# Altium project Thunderscope_Rev5.PrjPCB (part 2 of 2)

## Sheet CON_PCIe_X4.SchDoc: ThunderScope 1000E
size A4; DrawnBy: Aleksa Bjelogrlic; Revision: 1; SheetNumber: 13; SheetTotal: 14
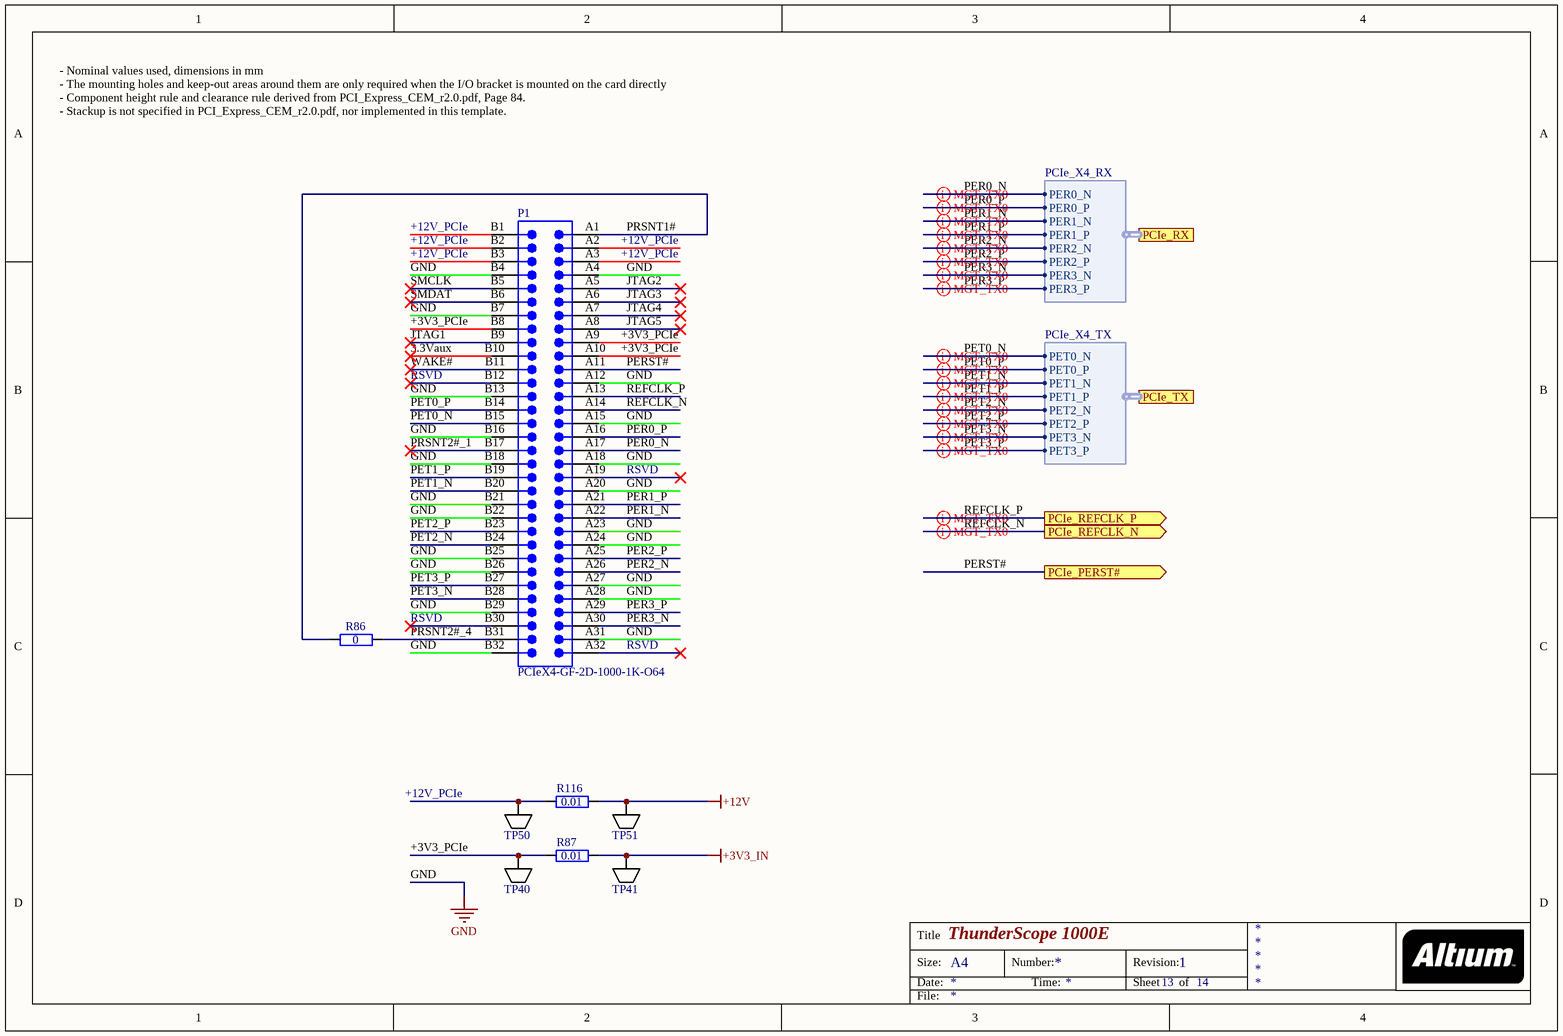
[diagram p9: CON_PCIe_X4.SchDoc]

### Parts
P1  PCIeX4-GF-2D-1000-1K-O64  [PCIeX4-GF-2D-1000-1K-O64]  (no BOM)
R86  0  [GEN_R_0402]
R87  0.01  [GEN_R_0603]
R116  0.01  [GEN_R_0603]
TP40  5015  [KEY_5015]  (value not drawn)
TP41  5015  [KEY_5015]  (value not drawn)
TP50  5015  [KEY_5015]  (value not drawn)
TP51  5015  [KEY_5015]  (value not drawn)

### Ports
PCIe_PERST# (out), PCIe_REFCLK_N (out), PCIe_REFCLK_P (out), PCIe_RX (harness PCIe_X4_RX), PCIe_TX (harness PCIe_X4_TX)

### Harnesses
PCIe_X4_RX: PER0_N, PER0_P, PER1_N, PER1_P, PER2_N, PER2_P, PER3_N, PER3_P
PCIe_X4_TX: PET0_N, PET0_P, PET1_N, PET1_P, PET2_N, PET2_P, PET3_N, PET3_P

### Nets
+3V3_IN: R87.2 TP41.1
+12V: R116.2 TP51.1
GND: P1.A4 P1.A12 P1.A15 P1.A18 P1.A20 P1.A23 P1.A24 P1.A27 P1.A28 P1.A31 P1.B4 P1.B7 P1.B13 P1.B16 P1.B18 P1.B21 P1.B22 P1.B25 P1.B26 P1.B29 P1.B32
3.3Vaux: P1.B10
+3V3_PCIe: P1.A9 P1.A10 P1.B8 R87.1 TP40.1
+12V_PCIe: P1.A2 P1.A3 P1.B1 P1.B2 P1.B3 R116.1 TP50.1
JTAG1: P1.B9
JTAG2: P1.A5
JTAG3: P1.A6
JTAG4: P1.A7
JTAG5: P1.A8
PER0_N: P1.A17 ; port PCIe_RX.PER0_N  [project net PCIe_PER0_N]
PER0_P: P1.A16 ; port PCIe_RX.PER0_P  [project net PCIe_PER0_P]
PER1_N: P1.A22 ; port PCIe_RX.PER1_N  [project net PCIe_PER1_N]
PER1_P: P1.A21 ; port PCIe_RX.PER1_P  [project net PCIe_PER1_P]
PER2_N: P1.A26 ; port PCIe_RX.PER2_N  [project net PCIe_PER2_N]
PER2_P: P1.A25 ; port PCIe_RX.PER2_P  [project net PCIe_PER2_P]
PER3_N: P1.A30 ; port PCIe_RX.PER3_N  [project net PCIe_PER3_N]
PER3_P: P1.A29 ; port PCIe_RX.PER3_P  [project net PCIe_PER3_P]
PERST#: P1.A11 ; port PCIe_PERST#  [project net PCIe_PERST#]
PET0_N: P1.B15 ; port PCIe_TX.PET0_N  [project net PCIe_PET0_N]
PET0_P: P1.B14 ; port PCIe_TX.PET0_P  [project net PCIe_PET0_P]
PET1_N: P1.B20 ; port PCIe_TX.PET1_N  [project net PCIe_PET1_N]
PET1_P: P1.B19 ; port PCIe_TX.PET1_P  [project net PCIe_PET1_P]
PET2_N: P1.B24 ; port PCIe_TX.PET2_N  [project net PCIe_PET2_N]
PET2_P: P1.B23 ; port PCIe_TX.PET2_P  [project net PCIe_PET2_P]
PET3_N: P1.B28 ; port PCIe_TX.PET3_N  [project net PCIe_PET3_N]
PET3_P: P1.B27 ; port PCIe_TX.PET3_P  [project net PCIe_PET3_P]
PRSNT1#: P1.A1 R86.1
PRSNT2#_1: P1.B17
PRSNT2#_4: P1.B31 R86.2
REFCLK_N: P1.A14 ; port PCIe_REFCLK_N  [project net PCIe_REFCLK_N]
REFCLK_P: P1.A13 ; port PCIe_REFCLK_P  [project net PCIe_REFCLK_P]
SMCLK: P1.B5
SMDAT: P1.B6
WAKE#: P1.B11

Not connected (* = marked no-connect by the designer): P1 A19* A32* B12* B30*

### Layout directives
differential pair; differential pair class PCIe: PCIe_PER0_N, PCIe_PER0_P, PCIe_PER1_N, PCIe_PER1_P, PCIe_PER2_N, PCIe_PER2_P, PCIe_PER3_N, PCIe_PER3_P, PCIe_PET0_N, PCIe_PET0_P, PCIe_PET1_N, PCIe_PET1_P, PCIe_PET2_N, PCIe_PET2_P, PCIe_PET3_N, PCIe_PET3_P, PCIe_REFCLK_N, PCIe_REFCLK_P

### Notes on the sheet
- - Nominal values used, dimensions in mm
  - The mounting holes and keep-out areas around them are only required when the I/O bracket is mounted on the card directly
  - Component height rule and clearance rule derived from PCI_Express_CEM_r2.0.pdf, Page 84.
  - Stackup is not specified in PCI_Express_CEM_r2.0.pdf, nor implemented in this template.
- RSVD
- (near R86) RSVD
- Title
- Size:
- Date:
- A4
- Number:
- Time:
- Revision:
- Sheet
- of
- File:

### Library data of the parts
P1 = CMP-0001-00031-2: Golden finger, PCIeX4, Dual, Opposite, Pitch 1mm, 64-Position; Mating Connector: Molex-87715-9106; Datasheet Version: rev2.0, Apr-2007; Package Reference: PCIeX4-GF-2D-1000-1K-O64; ClassName: Edge Connector; Publisher: Altium
R86 = RES 0 OHM 1/16W 0402: as R1 on sheet Main; Package: 0402; Supplier 1: Mouser; Supplier Part Number 1: 603-RC0402JR-070RL; Value: 0
R87 R116 = RES 0.01 OHM 1% 1/4W 0603: as R1046 on sheet FPGA_REG; Supplier 1: Mouser; Supplier Part Number 1: 754-RL0816T-R010-F; Value: 0.01; Package: 0603
TP40 TP41 TP50 TP51 = TP KEYSTONE 5015: Manufacturer: Keystone Electronics; Supplier 1: Mouser; Supplier Part Number 1: 534-5015; Manufacturer Part Number: 5015

## Sheet PWR.SchDoc: ThunderScope 1000E
size A4; SheetNumber: 6; SheetTotal: 14
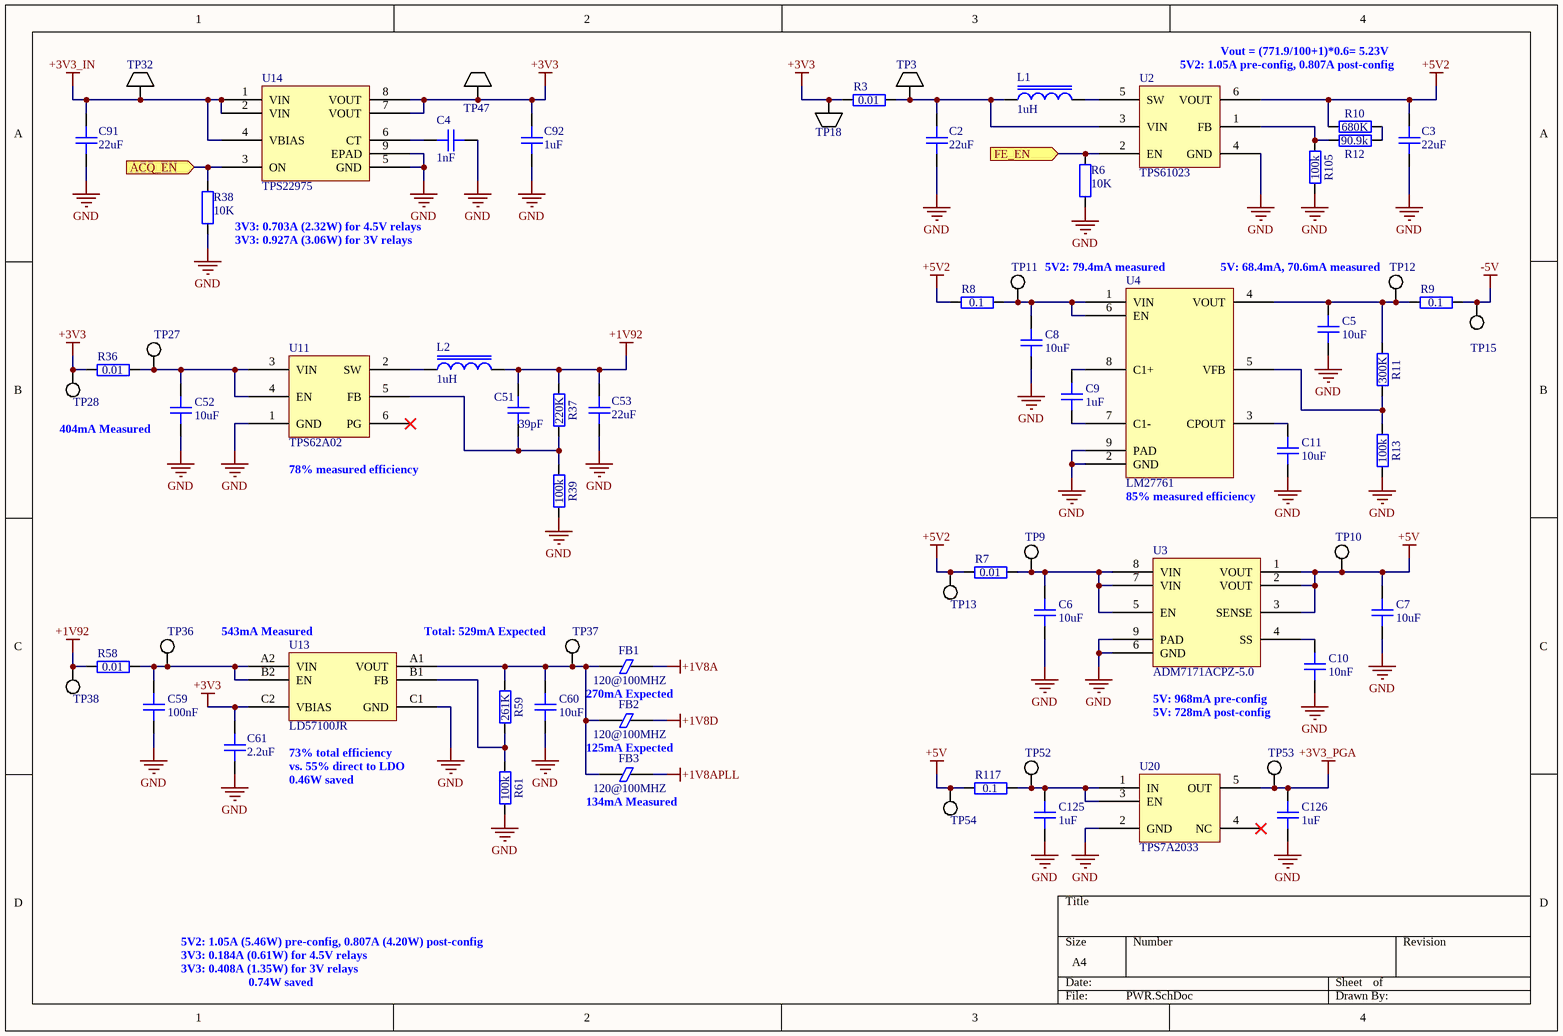
[diagram p10: PWR.SchDoc]

### Parts
C2  22uF  [GEN_C_0805]
C3  22uF  [GEN_C_0805]
C4  1nF  [GEN_C_0402]
C5  10uF  [GEN_C_0603]
C6  10uF  [GEN_C_0603]
C7  10uF  [GEN_C_0603]
C8  10uF  [GEN_C_0603]
C9  1uF  [GEN_C_0402]
C10  10nF  [GEN_C_0402]
C11  10uF  [GEN_C_0603]
C51  39pF  [GEN_C_0402]
C52  10uF  [GEN_C_0603]
C53  22uF  [GEN_C_0805]
C59  100nF  [GEN_C_0402]
C60  10uF  [GEN_C_0603]
C61  2.2uF  [GEN_C_0402]
C91  22uF  [GEN_C_0805]
C92  1uF  [GEN_C_0402]
C125  1uF  [GEN_C_0402]
C126  1uF  [GEN_C_0402]
FB1  120@100MHZ  [GEN_R_0402]
FB2  120@100MHZ  [GEN_R_0402]
FB3  120@100MHZ  [GEN_R_0402]
L1  1uH  [GEN_L_1210]
L2  1uH  [GEN_L_1210]
R3  0.01  [GEN_R_0603]
R6  10K  [GEN_R_0402]
R7  0.01  [GEN_R_0603]
R8  0.1  [GEN_R_0402]
R9  0.1  [GEN_R_0402]
R10  680K  [GEN_R_0402]
R11  300K  [GEN_R_0402]
R12  90.9k  [GEN_R_0402]
R13  100k  [GEN_R_0402]
R36  0.01  [GEN_R_0603]
R37  220K  [GEN_R_0402]
R38  10K  [GEN_R_0402]
R39  100k  [GEN_R_0402]
R58  0.01  [GEN_R_0603]
R59  261K  [GEN_R_0402]
R61  100k  [GEN_R_0402]
R105  100k  [GEN_R_0402]
R117  0.1  [GEN_R_0402]
TP3  5015  [KEY_5015]  (value not drawn)
TP9  PCB  [GEN_TP_PCB]  (value not drawn)  (no BOM)
TP10  PCB  [GEN_TP_PCB]  (value not drawn)  (no BOM)
TP11  PCB  [GEN_TP_PCB]  (value not drawn)  (no BOM)
TP12  PCB  [GEN_TP_PCB]  (value not drawn)  (no BOM)
TP13  PCB  [GEN_TP_PCB]  (value not drawn)  (no BOM)
TP15  PCB  [GEN_TP_PCB]  (value not drawn)  (no BOM)
TP18  5015  [KEY_5015]  (value not drawn)
TP27  PCB  [GEN_TP_PCB]  (value not drawn)  (no BOM)
TP28  PCB  [GEN_TP_PCB]  (value not drawn)  (no BOM)
TP32  5015  [KEY_5015]  (value not drawn)
TP36  PCB  [GEN_TP_PCB]  (value not drawn)  (no BOM)
TP37  PCB  [GEN_TP_PCB]  (value not drawn)  (no BOM)
TP38  PCB  [GEN_TP_PCB]  (value not drawn)  (no BOM)
TP47  5015  [KEY_5015]  (value not drawn)
TP52  PCB  [GEN_TP_PCB]  (value not drawn)  (no BOM)
TP53  PCB  [GEN_TP_PCB]  (value not drawn)  (no BOM)
TP54  PCB  [GEN_TP_PCB]  (value not drawn)  (no BOM)
U2  TPS61023  [TI_SOT563_DRL0006A]
U3  ADM7171ACPZ-5.0  [AD_DFN8_CP-8-21]
U4  LM27761  [TI_WSON8_DSG0008A]
U11  TPS62A02  [TI_SOT563_DRL0006A]
U13  LD57100JR  [ST_FlipChip6]
U14  TPS22975  [TI_WSON8_DSG0008A]
U20  TPS7A2033  [GEN_SOT23_5_950_2900X1600X1450]

### Ports
ACQ_EN (in), FE_EN (in)

### Nets
+1V8A: FB1.2
+1V8APLL: FB3.2
+1V8D: FB2.2
+1V92: C51.2 C53.2 L2.2 R37.2 R58.1 TP38.1
+3V3: C61.2 C92.2 R3.2 R36.1 TP18.1 TP28.1 TP47.1 U13.C2(VBIAS) U14.7(VOUT) U14.8(VOUT)
+3V3_IN: C91.2 TP32.1 U14.1(VIN) U14.2(VIN) U14.4(VBIAS)
+3V3_PGA: C126.2 TP53.1 U20.5(OUT)
+5V: C7.2 R117.1 TP10.1 TP54.1 U3.1(VOUT) U3.2(VOUT) U3.3(SENSE)
+5V2: C3.2 R7.1 R8.1 R10.2 TP13.1 U2.6(VOUT)
-5V: R9.2 TP15.1
GND: C2.1 C3.1 C4.1 C5.1 C6.1 C7.1 C8.1 C10.1 C11.1 C52.1 C53.1 C59.1 C60.1 C61.1 C91.1 C92.1 C125.1 C126.1 R6.2 R13.1 R38.1 R39.1 R61.1 R105.1 U2.4(GND) U3.6(GND) U3.9(PAD) U4.2(GND) U4.9(PAD) U11.1(GND) U13.C1(GND) U14.5(GND) U14.9(EPAD) U20.2(GND)
ACQ_EN: R38.2 U14.3(ON) ; port ACQ_EN
FE_EN: R6.1 U2.2(EN) ; port FE_EN
NetC2_2: C2.2 L1.1 R3.1 TP3.1 U2.3(VIN)
NetC4_2: C4.2 U14.6(CT)
NetC5_2: C5.2 R9.1 R11.2 TP12.1 U4.4(VOUT)
NetC6_2: C6.2 R7.2 TP9.1 U3.5(EN) U3.7(VIN) U3.8(VIN)
NetC8_2: C8.2 R8.2 TP11.1 U4.1(VIN) U4.6(EN)
NetC9_1: C9.1 U4.7(C1-)
NetC9_2: C9.2 U4.8(C1+)
NetC10_2: C10.2 U3.4(SS)
NetC11_2: C11.2 U4.3(CPOUT)
NetC51_1: C51.1 R37.1 R39.2 U11.5(FB)
NetC52_2: C52.2 R36.2 TP27.1 U11.3(VIN) U11.4(EN)
NetC59_2: C59.2 R58.2 TP36.1 U13.A2(VIN) U13.B2(EN)
NetC60_2: C60.2 FB1.1 FB2.1 FB3.1 R59.2 TP37.1 U13.A1(VOUT)
NetC125_2: C125.2 R117.2 TP52.1 U20.1(IN) U20.3(EN)
NetL1_2: L1.2 U2.5(SW)
NetL2_1: L2.1 U11.2(SW)
NetR10_1: R10.1 R12.2
NetR11_1: R11.1 R13.2 U4.5(VFB)
NetR12_1: R12.1 R105.2 U2.1(FB)
NetR59_1: R59.1 R61.2 U13.B1(FB)

Not connected (* = marked no-connect by the designer): U11 6(PG)*; U20 4(NC)*

### Notes on the sheet
- (near U2) 5V2: 1.05A pre-config, 0.807A post-config
- (near U2) Vout = (771.9/100+1)*0.6= 5.23V
- (near R38) 3V3: 0.703A (2.32W) for 4.5V relays
- (near R38) 3V3: 0.927A (3.06W) for 3V relays
- 5V2: 79.4mA measured
- 5V: 68.4mA, 70.6mA measured
- 404mA Measured
- (near U11) 78% measured efficiency
- 85% measured efficiency
- (near U13) 543mA Measured
- Total: 529mA Expected
- 270mA Expected
- 5V: 968mA pre-config
- 5V: 728mA post-config
- 73% total efficiency
- vs. 55% direct to LDO
- 0.46W saved
- 125mA Expected
- (near FB3) 134mA Measured
- 5V2: 1.05A (5.46W) pre-config, 0.807A (4.20W) post-config
- 3V3: 0.184A (0.61W) for 4.5V relays
- 3V3: 0.408A (1.35W) for 3V relays
- 0.74W saved

### Library data of the parts
C2 C3 C53 C91 = CAP 22uF 25V X5R 0805: House Part Number: C-22uF-0805-002; Manufacturer: Murata; Manufacturer Part Number: GRM21BR61E226ME44L; Voltage Rating: 25V; Package: 0805; Value: 22uF; Supplier 1: Mouser; Supplier Part Number 1: 81-GRM21BR61E226ME4L
C4 = CAP 1nF 50V C0G 0402: Manufacturer: Murata; Manufacturer Part Number: GRM1555C1H102FA01D; Voltage Rating: 50V; Package: 0402; Supplier 1: Mouser; Supplier Part Number 1: 81-GRM1555C1H102FA1D; Value: 1nF
C5-C8 C11 C52 C60 = CAP 10uF 10V X5R 0603: House Part Number: C-10uF-0603-002; Manufacturer: Murata; Manufacturer Part Number: GRM188R61A106ME69D; Voltage Rating: 10V; Package: 0402; Supplier 1: Mouser; Supplier Part Number 1: 81-GRM188R61A106ME9D; Value: 10uF
C9 C92 C125 C126 = CAP 1uF 25V X5R 0402: Manufacturer: Murata; Manufacturer Part Number: GRM155R61E105KA12D; Voltage Rating: 25V; Package: 0402; Supplier 1: Mouser; Supplier Part Number 1: 81-GRM155R61E105KA2D; Value: 1uF
C10 = CAP 10nF 50V X7R 0402: Manufacturer: Murata; House Part Number: C-10nF-0402-002; Manufacturer Part Number: GRM155R71H103KA88J; Voltage Rating: 50V; Package: 0402; Supplier 1: Mouser; Supplier Part Number 1: 81-GRM155R71H103KA8J; Value: 10nF
C51 = CAP 39pF 50V C0G 0402: House Part Number: C-39pF-0402-002; Manufacturer: KEMET; Manufacturer Part Number: C0402C390J5GACTU; Temperature Coefficient: C0G; Voltage Rating: 50V; Package: 0402; Value: 39pF; Supplier 1: Mouser; Supplier Part Number 1: 80-C0402C390J5G
C59 = CAP 100nF 16V X7R 0402: House Part Number: C-100nF-0402-002; Manufacturer: Murata; Manufacturer Part Number: GCM155R71C104KA55D; Voltage Rating: 16V; Package: 0402; Supplier 1: Mouser; Supplier Part Number 1: 81-GCM155R71C104KA5D; Value: 100nF
C61 = CAP 2.2uF 10V X5R 0402: Manufacturer: Taiyo Yuden; Manufacturer Part Number: LMK105BJ225MV-F; Voltage Rating: 10V; Package: 0402; Value: 2.2uF; Supplier 1: Mouser; Supplier Part Number 1: 963-LMK105BJ225MV-F
FB1-FB3 = FERRITE BEAD 120 OHM 0402: House Part Number: BLM15PX121SN1D; Manufacturer: Murata; Supplier 1: Mouser; Supplier Part Number 1: 81-BLM15PX121SN1D; Manufacturer Part Number: BLM15PX121SN1D
L1 L2 = IND 1uH 3.1A 45 MOHM 1210: Manufacturer: Murata; Manufacturer Part Number: 1277AS-H-1R0M=P2; Value: 1uH; Supplier 1: Mouser; Supplier Part Number 1: 81-1277AS-H-1R0MP2
R3 R7 R36 R58 = RES 0.01 OHM 1% 1/4W 0603: House Part Number: R-0.01-0603-1%-001; Manufacturer: Susumu; Manufacturer Part Number: RL0816T-R010-F; Tolerance: 1%; Supplier 1: Mouser; Supplier Part Number 1: 754-RL0816T-R010-F; Value: 0.01; Package: 0603
R6 R38 = RES 10K OHM 1% 1/10W 0402: Manufacturer: Panasonic; Manufacturer Part Number: ERJ-2RKF1002X; Tolerance: 1%; Package: 0402; Supplier 1: Mouser; Supplier Part Number 1: 667-ERJ-2RKF1002X; Value: 10K
R8 R9 R117 = RES 0.1 OHM 1% 1/6W 0402: Manufacturer: Panasonic; Manufacturer Part Number: ERJ-2BSFR10X; Tolerance: 1%; Package: 0402; Supplier 1: Mouser; Supplier Part Number 1: 667-ERJ-2BSFR10X; Value: 0.1
R10 = RES 680K OHM 1% 1/16W 0402: Manufacturer: Yageo; Manufacturer Part Number: RC0402FR-07681KL; Tolerance: 1%; Package: 0402; Supplier 1: Mouser; Supplier Part Number 1: 603-RC0402FR-07680KL; Value: 680K
R11 = RES 300K OHM 1% 1/10W 0402: Manufacturer: Panasonic; Manufacturer Part Number: ERJ-2RKF3003X; Tolerance: 1%; Package: 0402; Supplier 1: Mouser; Supplier Part Number 1: 667-ERJ-2RKF3003X; Value: 300K
R12 = RES 90.9K OHM 1% 1/16W 0402: Manufacturer: Yageo; Manufacturer Part Number: RC0402FR-0790K9L; Tolerance: 1%; Package: 0402; Supplier 1: Mouser; Supplier Part Number 1: 603-RC0402FR-0790K9L; Value: 90.9k
R13 R39 R61 R105 = RES 100K OHM 1% 1/10W 0402: House Part Number: R-100K-0402-1%-001; Manufacturer: Yageo; Manufacturer Part Number: RC0402FR-07100KL; Tolerance: 1%; Package: 0402; Supplier 1: Mouser; Supplier Part Number 1: 603-RC0402FR-07100KL; Value: 100k
R37 = RES 220K OHM 1% 1/16W 0402: Manufacturer: Yageo; Manufacturer Part Number: RC0402FR-07220KL; Tolerance: 1%; Package: 0402; Value: 220K; Supplier 1: Mouser; Supplier Part Number 1: 603-RC0402FR-07220KL
R59 = RES 261K OHM 1% 1/16W 0402: Manufacturer: Yageo; Manufacturer Part Number: RC0402FR-07261KL; Tolerance: 1%; Package: 0402; Value: 261K; Supplier 1: Mouser; Supplier Part Number 1: 603-RC0402FR-07261KL
TP3 TP18 TP32 TP47 = TP KEYSTONE 5015: Manufacturer: Keystone Electronics; Supplier 1: Mouser; Supplier Part Number 1: 534-5015; Manufacturer Part Number: 5015
TP9-TP13 TP15 TP27 TP28 TP36-TP38 TP52-TP54 = TP PCB 1mm
U2 = IC BOOST TPS61023: Manufacturer: Texas Instruments; Manufacturer Part Number: TPS61023DRLT; Supplier 1: Texas Instruments; Supplier Part Number 1: TPS61023DRLT
U3 = IC LDO ADM7171ACPZ-5.0: Manufacturer: Analog Devices; Manufacturer Part Number: ADM7171ACPZ-5.0-R7; Supplier 1: Mouser; Supplier Part Number 1: 584-ADM7171ACPZ5.0R7
U4 = IC CPUMP LM27761: Manufacturer: Texas Instruments; Manufacturer Part Number: LM27761DSGR; Supplier 1: Texas Instruments; Supplier Part Number 1: LM27761DSGR
U11 = IC BUCK TPS62A02: House Part Number: TPS62A02DRLR; Manufacturer: Texas Instruments; Supplier 1: Texas Instruments; Supplier Part Number 1: TPS62A02DRLR; Manufacturer Part Number: TPS62A02DRLR
U13 = IC LDO LD57100JR: Manufacturer: STMicroelectronics; Supplier 1: Mouser; Supplier Part Number 1: 511-LD57100JR; House Part Number: LD57100JR; Manufacturer Part Number: LD57100JR
U14 = IC SWITCH LOAD TPS22975: Manufacturer: Texas Instruments; Manufacturer Part Number: TPS22975DSGR; Supplier 1: Texas Instruments; Supplier Part Number 1: TPS22975DSGR
U20 = IC LDO TPS7A2033: Manufacturer: Texas Instruments; Manufacturer Part Number: TPS7A2033PDBVR; Supplier 1: Texas Instruments; Supplier Part Number 1: TPS7A2033PDBVR

## Sheet FE_Channel.SchDoc: ThunderScope 1000E
size A3; DrawnBy: Aleksa Bjelogrlic; Revision: 1; SheetNumber: 2; SheetTotal: 14
Used 4 times, as channels CH1, CH2, CH3, CH4. Parts and nets are listed once, with the designators drawn on the sheet.
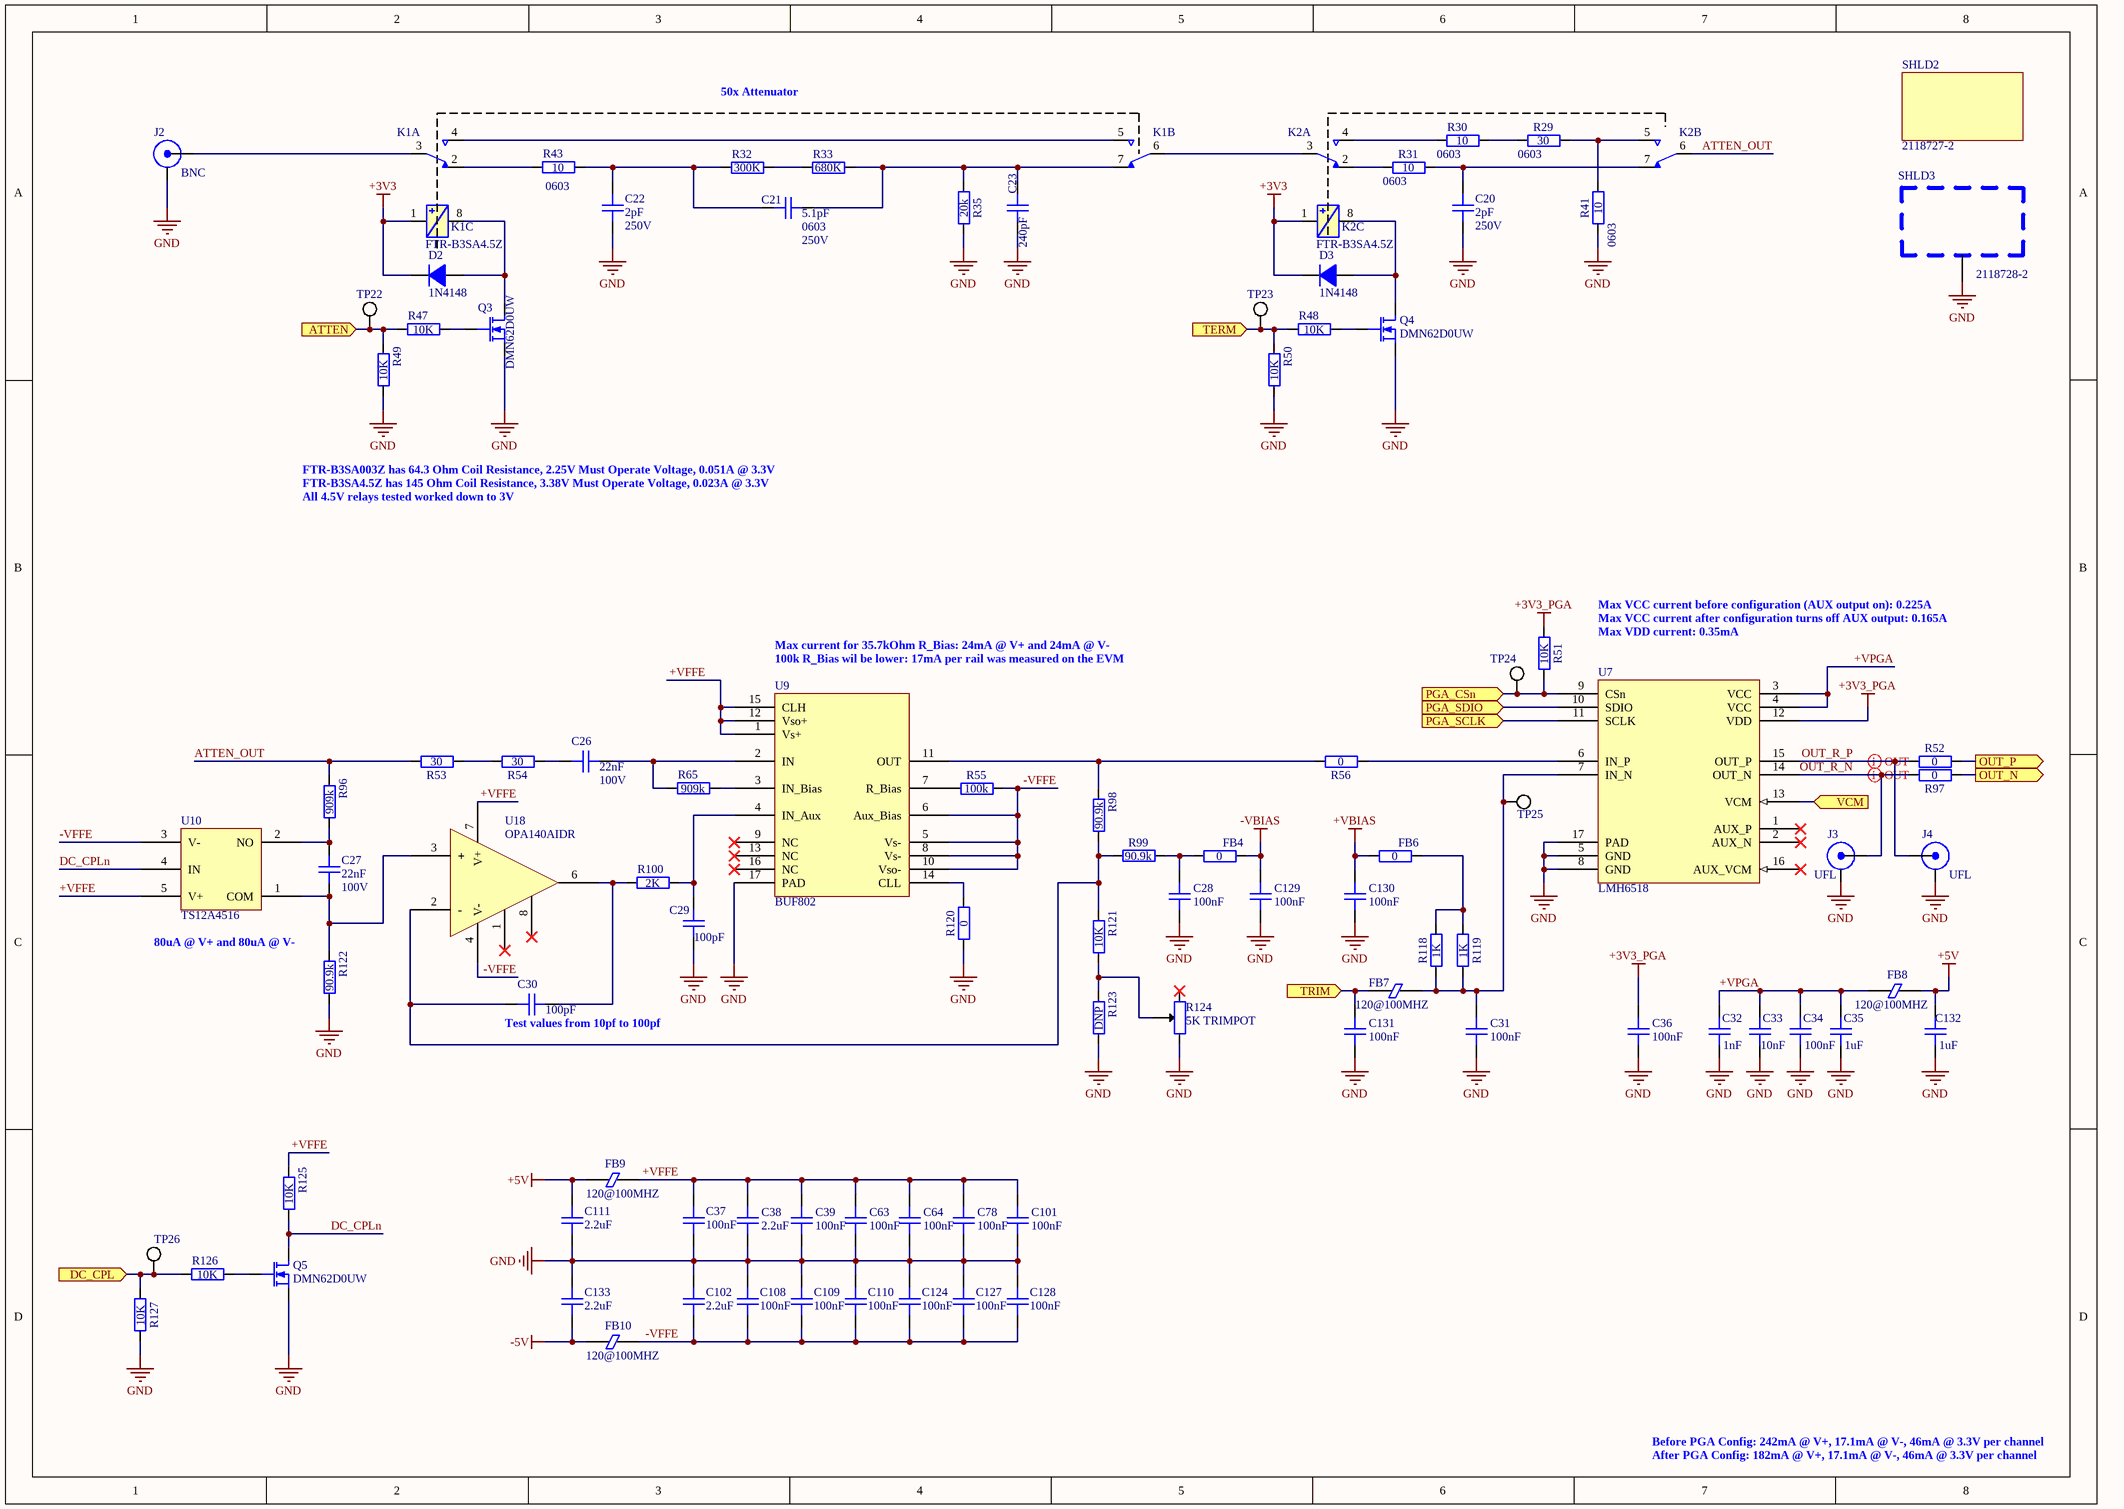
[diagram p11: FE_Channel.SchDoc]

### Parts
C20  2pF  Voltage Rating: 250V  [GEN_C_0603]
C21  5.1pF  Package: 0603  Voltage Rating: 250V  [GEN_C_0603]
C22  2pF  Voltage Rating: 250V  [GEN_C_0603]
C23  240pF  [GEN_C_0805]
C26  22nF  Voltage Rating: 100V  [GEN_C_0603]
C27  22nF  Voltage Rating: 100V  [GEN_C_0603]
C28  100nF  [GEN_C_0402]
C29  100pF  [GEN_C_0402]
C30  100pF  [GEN_C_0402]
C31  100nF  [GEN_C_0402]
C32  1nF  [GEN_C_0402]
C33  10nF  [GEN_C_0402]
C34  100nF  [GEN_C_0402]
C35  1uF  [GEN_C_0402]
C36  100nF  [GEN_C_0402]
C37  100nF  [GEN_C_0402]
C38  2.2uF  [GEN_C_0402]
C39  100nF  [GEN_C_0402]
C63  100nF  [GEN_C_0402]
C64  100nF  [GEN_C_0402]
C78  100nF  [GEN_C_0402]
C101  100nF  [GEN_C_0402]
C102  2.2uF  [GEN_C_0402]
C108  100nF  [GEN_C_0402]
C109  100nF  [GEN_C_0402]
C110  100nF  [GEN_C_0402]
C111  2.2uF  [GEN_C_0402]
C124  100nF  [GEN_C_0402]
C127  100nF  [GEN_C_0402]
C128  100nF  [GEN_C_0402]
C129  100nF  [GEN_C_0402]
C130  100nF  [GEN_C_0402]
C131  100nF  [GEN_C_0402]
C132  1uF  [GEN_C_0402]
C133  2.2uF  [GEN_C_0402]
D2  1N4148  [GEN_SOD_323]
D3  1N4148  [GEN_SOD_323]
FB4  0  [GEN_R_0402]
FB6  0  [GEN_R_0402]
FB7  120@100MHZ  [GEN_R_0402]
FB8  120@100MHZ  [GEN_R_0402]
FB9  120@100MHZ  [GEN_R_0402]
FB10  120@100MHZ  [GEN_R_0402]
J2  BNC  [MOL_0731000105]
J3  UFL  [TE_2334884-1]
J4  UFL  [TE_2334884-1]
K1  FTR-B3SA4.5Z  [FUJ_FTR-B3SA]  (value not drawn)  (parts A,B,C of 3)
K2  FTR-B3SA4.5Z  [FUJ_FTR-B3SA]  (value not drawn)  (parts A,B,C of 3)
Q3  DMN62D0UW  [GEN_SOT_323]
Q4  DMN62D0UW  [GEN_SOT_323]
Q5  DMN62D0UW  [GEN_SOT_323]
R29  30  Package: 0603  [GEN_R_0603]
R30  10  Package: 0603  [GEN_R_0603]
R31  10  Package: 0603  [GEN_R_0603]
R32  300K  [GEN_R_0402]
R33  680K  [GEN_R_0402]
R35  20k  [GEN_R_0402]
R41  10  Package: 0603  [GEN_R_0603]
R43  10  Package: 0603  [GEN_R_0603]
R47  10K  [GEN_R_0402]
R48  10K  [GEN_R_0402]
R49  10K  [GEN_R_0402]
R50  10K  [GEN_R_0402]
R51  10K  [GEN_R_0402]
R52  0  [GEN_R_0402]
R53  30  [GEN_R_0603]
R54  30  [GEN_R_0603]
R55  100k  [GEN_R_0402]
R56  0  [GEN_R_0402]
R65  909k  [GEN_R_0402]
R96  909k  [GEN_R_0402]
R97  0  [GEN_R_0402]
R98  90.9k  [GEN_R_0402]
R99  90.9k  [GEN_R_0402]
R100  2K  [GEN_R_0402]
R118  1K  [GEN_R_0402]
R119  1K  [GEN_R_0402]
R120  0  [GEN_R_0402]
R121  10K  [GEN_R_0402]
R122  90.9k  [GEN_R_0402]
R123  DNP  [GEN_R_0402]  (no BOM)
R124  5K TRIMPOT  [BOU_3mm_POT]
R125  10K  [GEN_R_0402]
R126  10K  [GEN_R_0402]
R127  10K  [GEN_R_0402]
SHLD2  2118727-2  (mechanical)
SHLD3  2118728-2  [TE_2118728-2]
TP22  PCB  [GEN_TP_PCB]  (value not drawn)  (no BOM)
TP23  PCB  [GEN_TP_PCB]  (value not drawn)  (no BOM)
TP24  PCB  [GEN_TP_PCB]  (value not drawn)  (no BOM)
TP25  PCB  [GEN_TP_PCB]  (value not drawn)  (no BOM)
TP26  PCB  [GEN_TP_PCB]  (value not drawn)  (no BOM)
U7  LMH6518  [TI_WQFN_RGH0016A]
U9  BUF802  [TI_VQFN_RGT0016C]
U10  TS12A4516  [GEN_SOT23_5_950_2900X1600X1450]
U18  OPA140AIDR  [TI_SOIC8_D0008A]

### Ports
ATTEN (in), DC_CPL (in), OUT_N (out), OUT_P (out), PGA_CSn (in), PGA_SCLK (in), PGA_SDIO (in), TERM (in), TRIM (in), VCM (in)

### Nets
+3V3: D2.1(K) D3.1(K) K1.1 K2.1
+3V3_PGA: C36.2 R51.2 U7.12(VDD)
+5V: C111.2 C132.2 FB8.2 FB9.1
+VBIAS: C130.1 FB6.1
-5V: C133.1 FB10.1
-VBIAS: C129.1 FB4.2
GND: C20.2 C22.1 C23.1 C28.2 C29.1 C31.2 C32.1 C33.1 C34.1 C35.1 C36.1 C37.1 C38.2 C39.2 C63.2 C64.1 C78.1 C101.1 C102.1 C108.1 C109.2 C110.2 C111.1 C124.2 C127.1 C128.1 C129.2 C130.2 C131.2 C132.1 C133.2 J2.2(SHIELD) J3.2(SHIELD) J4.2(SHIELD) Q3.3(S) Q4.3(S) Q5.3(S) R35.1 R41.1 R49.1 R50.1 R120.1 R122.1 R123.1 R124.3 R127.1 SHLD3.1 U7.5(GND) U7.8(GND) U7.17(PAD) U9.17(PAD)
+VFFE: C37.2 C38.1 C39.1 C63.1 C64.2 C78.2 C101.2 FB9.2 R125.2 U9.1(Vs+) U9.12(Vso+) U9.15(CLH) U10.5(V+) U18.7(V+)
+VPGA: C32.2 C33.2 C34.2 C35.2 FB8.1 U7.3(VCC) U7.4(VCC)
-VFFE: C102.2 C108.2 C109.1 C110.1 C124.1 C127.2 C128.2 FB10.2 R55.2 U9.5(Vs-) U9.6(Aux_Bias) U9.8(Vs-) U9.10(Vso-) U10.3(V-) U18.4(V-)
ATTEN: R47.2 R49.2 TP22.1 ; port ATTEN
ATTEN_OUT: K2.6 R53.1 R96.2
DC_CPL: R126.2 R127.2 TP26.1 ; port DC_CPL
DC_CPLn: Q5.1(D) R125.1 U10.4(IN)
OUT_N: R97.2 ; port OUT_N
OUT_P: R52.2 ; port OUT_P
OUT_R_N: J3.1(Signal) R97.1 U7.14(OUT_N)
OUT_R_P: J4.1(Signal) R52.1 U7.15(OUT_P)
PGA_CSn: R51.1 TP24.1 U7.9(CSn) ; port PGA_CSn
PGA_SCLK: U7.11(SCLK) ; port PGA_SCLK
PGA_SDIO: U7.10(SDIO) ; port PGA_SDIO
TERM: R48.2 R50.2 TP23.1 ; port TERM
TRIM: C131.1 FB7.1 ; port TRIM
VCM: U7.13(VCM) ; port VCM
NetC20_1: C20.1 K2.7 R31.2
NetC21_1: C21.1 C23.2 K1.7 R33.2 R35.2
NetC21_2: C21.2 C22.2 R32.1 R43.1
NetC26_1: C26.1 R65.2 U9.2(IN)
NetC26_2: C26.2 R54.2
NetC27_1: C27.1 R96.1 U10.2(NO)
NetC27_2: C27.2 R122.2 U10.1(COM) U18.3(+)
NetC28_1: C28.1 FB4.1 R99.1
NetC29_2: C29.2 R100.1 U9.4(IN_Aux)
NetC30_1: C30.1 R100.2 U18.6(OUT)
NetC30_2: C30.2 R98.1 R99.2 R121.2 U18.2(-)
NetC31_1: C31.1 FB7.2 R118.1 R119.2 TP25.1 U7.7(IN_N)
NetD2_2: D2.2(A) K1.8 Q3.1(D)
NetD3_2: D3.2(A) K2.8 Q4.1(D)
NetFB6_2: FB6.2 R118.2 R119.1
NetJ2_1: J2.1(Signal) K1.3
NetK1_2: K1.2 R43.2
NetK1_4: K1.4 K1.5
NetK1_6: K1.6 K2.3
NetK2_2: K2.2 R31.1
NetK2_4: K2.4 R30.1
NetK2_5: K2.5 R29.2 R41.2
NetQ3_2: Q3.2(G) R47.1
NetQ4_2: Q4.2(G) R48.1
NetQ5_2: Q5.2(G) R126.1
NetR29_1: R29.1 R30.2
NetR32_2: R32.2 R33.1
NetR53_2: R53.2 R54.1
NetR55_1: R55.1 U9.7(R_Bias)
NetR56_1: R56.1 R98.2 U9.11(OUT)
NetR56_2: R56.2 U7.6(IN_P)
NetR65_1: R65.1 U9.3(IN_Bias)
NetR120_2: R120.2 U9.14(CLL)
NetR121_1: R121.1 R123.2 R124.2

Not connected (* = marked no-connect by the designer): R124 1*; U7 1(AUX_P)* 2(AUX_N)* 16(AUX_VCM)*; U9 9(NC)* 13(NC)* 16(NC)*; U18 1(N1)* 8(N2)*

### Channels
CH1: designators end in A; ports ATTEN=ATTEN_1 DC_CPL=DC_CPL_1 OUT_N=CH1_N OUT_P=CH1_P PGA_CSn=PGA_CSn_1 PGA_SCLK=ADC_SCLK PGA_SDIO=ADC_SDATA TERM=TERM_1 TRIM=TRIM_1 VCM=VCM
CH2: designators end in B; ports ATTEN=ATTEN_2 DC_CPL=DC_CPL_2 OUT_N=CH2_N OUT_P=CH2_P PGA_CSn=PGA_CSn_2 PGA_SCLK=PGA_SCLK PGA_SDIO=PGA_SDIO TERM=TERM_2 TRIM=TRIM_2 VCM=VCM
CH3: designators end in C; ports ATTEN=ATTEN_3 DC_CPL=DC_CPL_3 OUT_N=CH3_N OUT_P=CH3_P PGA_CSn=PGA_CSn_3 PGA_SCLK=PGA_SCLK PGA_SDIO=PGA_SDIO TERM=TERM_3 TRIM=TRIM_3 VCM=VCM
CH4: designators end in D; ports ATTEN=ATTEN_4 DC_CPL=DC_CPL_4 OUT_N=CH4_N OUT_P=CH4_P PGA_CSn=PGA_CSn_4 PGA_SCLK=PGA_SCLK PGA_SDIO=PGA_SDIO TERM=TERM_4 TRIM=TRIM_4 VCM=VCM

### Layout directives
differential pair; differential pair class 100Z_Diff_PGA: OUT_R_N_CH1, OUT_R_P_CH1

### Notes on the sheet
- 50x Attenuator
- FTR-B3SA003Z has 64.3 Ohm Coil Resistance, 2.25V Must Operate Voltage, 0.051A @ 3.3V
- FTR-B3SA4.5Z has 145 Ohm Coil Resistance, 3.38V Must Operate Voltage, 0.023A @ 3.3V
- All 4.5V relays tested worked down to 3V
- Max current for 35.7kOhm R_Bias: 24mA @ V+ and 24mA @ V-
- Max VCC current before configuration (AUX output on): 0.225A
- Max VCC current after configuration turns off AUX output: 0.165A
- Max VDD current: 0.35mA
- (near U9) 100k R_Bias wil be lower: 17mA per rail was measured on the EVM
- 80uA @ V+ and 80uA @ V-
- (near C30) Test values from 10pf to 100pf
- Before PGA Config: 242mA @ V+, 17.1mA @ V-, 46mA @ 3.3V per channel
- After PGA Config: 182mA @ V+, 17.1mA @ V-, 46mA @ 3.3V per channel

### Library data of the parts
C20 C22 = CAP 2pF 250V C0G 0603: Manufacturer: KEMET; Manufacturer Part Number: CBR06C309BAGAC; Value: 2pF; Supplier 1: Mouser; Supplier Part Number 1: 80-CBR06C209BAG; Package: 0603
C21 = CAP 5.1pF 250V C0G 0603: Manufacturer: KEMET; Manufacturer Part Number: CBR06C519BAGAC; Supplier 1: Mouser; Supplier Part Number 1: 80-CBR06C519BAGAC; Value: 5.1pF
C23 = CAP 240pF 250V C0G 0805: Manufacturer: Kyocera AVX; Manufacturer Part Number: 600F241FT250XT; Voltage Rating: 250V; Temperature Coefficient: C0G; Package: 0805; Supplier 1: Mouser; Supplier Part Number 1: 581-600F241FT; Value: 240pF
C26 C27 = CAP 22nF 100V X7R 0603: Manufacturer: Murata; Manufacturer Part Number: GCM188R72A223KA37D; Package: 0603; Value: 22nF; Supplier 1: Mouser; Supplier Part Number 1: 81-GCM188R72A223KA7D
C28 C31 C34 C36 C39 C63 C64 C78 C101 C108-C110 C124 C127-C131 = CAP 100nF 16V X7R 0402: as C59 on sheet PWR; Package: 0402; Supplier 1: Mouser; Supplier Part Number 1: 81-GCM155R71C104KA5D; Value: 100nF
C29 C30 = CAP 100pF 50V C0G 0402: Manufacturer: Murata; Manufacturer Part Number: GCM1555C1H101FA16D; Temperature Coefficient: C0G; Voltage Rating: 50V; Package: 0402; Value: 100pF; Supplier 1: Mouser; Supplier Part Number 1: 81-GCM1555C1H101FA6D
C32 = CAP 1nF 50V C0G 0402: as C4 on sheet PWR; Package: 0402; Supplier 1: Mouser; Supplier Part Number 1: 81-GRM1555C1H102FA1D; Value: 1nF
C33 = CAP 10nF 50V X7R 0402: House Part Number: C-10nF-0402-002; Manufacturer: Murata; Manufacturer Part Number: GRM155R71H103KA88J; Voltage Rating: 50V; Package: 0402; Supplier 1: Mouser; Supplier Part Number 1: 81-GRM155R71H103KA8J; Value: 10nF
C35 C132 = CAP 1uF 25V X5R 0402: as C9 on sheet PWR; Package: 0402; Supplier 1: Mouser; Supplier Part Number 1: 81-GRM155R61E105KA2D; Value: 1uF
C37 = CAP 100nF 16V X7R 0402: Manufacturer: Murata; House Part Number: C-100nF-0402-002; Manufacturer Part Number: GCM155R71C104KA55D; Voltage Rating: 16V; Package: 0402; Supplier 1: Mouser; Supplier Part Number 1: 81-GCM155R71C104KA5D; Value: 100nF
C38 C102 C111 C133 = CAP 2.2uF 10V X5R 0402: as C61 on sheet PWR; Package: 0402; Supplier 1: Mouser; Supplier Part Number 1: 963-LMK105BJ225MV-F; Value: 2.2uF
D2 D3 = DIODE 1N4148: Manufacturer: Diodes; Manufacturer Part Number: 1N4148WS-7-F; Supplier 1: Mouser; Supplier Part Number 1: 621-1N4148WS-F
FB4 FB6 R52 R56 R97 R120 = RES 0 OHM 1/16W 0402: Manufacturer: Yageo; Manufacturer Part Number: RC0402JR-070RL; Supplier 1: Mouser; Supplier Part Number 1: 603-RC0402JR-070RL; Package: 0402; Value: 0
FB7-FB10 = FERRITE BEAD 120 OHM 0402: as FB1-FB3 on sheet PWR; Supplier 1: Mouser; Supplier Part Number 1: 81-BLM15PX121SN1D; Manufacturer Part Number: BLM15PX121SN1D
J2 = BNC JACK R/A: Manufacturer: Molex; Manufacturer Part Number: 73100-0105; Supplier 1: Mouser; Supplier Part Number 1: 538-73100-0105
J3 J4 = UFL Jack SMD: Manufacturer: TE Connectivity; Manufacturer Part Number: 2334884-1; Supplier 1: Mouser; Supplier Part Number 1: 571-2334884-1
K1 K2 = RELAY DPDT-NO FTR-B3SA4.5Z: Manufacturer: Fujitsu; Supplier 1: Mouser; Supplier Part Number 1: 817-FTRB3SA4.5Z-B10; Manufacturer Part Number: FTR-B3SA4.5Z
Q3-Q5 = NMOS DMN62D0UW: House Part Number: DMN62D0UW-7; Manufacturer: Diodes; Vdss: 60V; Supplier 1: Mouser; Supplier Part Number 1: 621-DMN62D0UW-7; Manufacturer Part Number: DMN62D0UW-7
R29 R53 R54 = RES 30 OHM 1% 1/3W 0603: Manufacturer: KOA Speer; Manufacturer Part Number: SG73P1JTTD30R0F; Tolerance: 1%; Value: 30; Supplier 1: Mouser; Supplier Part Number 1: 660-SG73P1JTTD30R0F
  R53 R54: Package: 0603
R30 R31 R41 R43 = RES 10 OHM 1% 1/3W 0603: Manufacturer: KOA Speer; Manufacturer Part Number: SG73P1JTTD10R0F; Tolerance: 1%; Value: 10; Supplier 1: Mouser; Supplier Part Number 1: 660-SG73P1JTTD10R0F
R32 = RES 300K OHM 1% 1/10W 0402: as R11 on sheet PWR; Package: 0402; Supplier 1: Mouser; Supplier Part Number 1: 667-ERJ-2RKF3003X; Value: 300K
R33 = RES 680K OHM 1% 1/16W 0402: as R10 on sheet PWR; Package: 0402; Supplier 1: Mouser; Supplier Part Number 1: 603-RC0402FR-07680KL; Value: 680K
R35 = RES 20K OHM 1% 1/16W 0402: Manufacturer: Yageo; Manufacturer Part Number: RC0402FR-0720KL; Tolerance: 1%; Package: 0402; Supplier 1: Mouser; Supplier Part Number 1: 603-RC0402FR-0720KL; Value: 20k
R47-R51 R121 R125-R127 = RES 10K OHM 1% 1/10W 0402: as R6 on sheet PWR; Package: 0402; Supplier 1: Mouser; Supplier Part Number 1: 667-ERJ-2RKF1002X; Value: 10K
R55 = RES 100K OHM 1% 1/10W 0402: as R13 on sheet PWR; Package: 0402; Value: 100k; Supplier 1: Mouser; Supplier Part Number 1: 603-RC0402FR-07100KL
R65 R96 = RES 909K OHM 1% 1/16W 0402: Manufacturer: Yageo; Manufacturer Part Number: RC0402FR-07909KL; Tolerance: 1%; Package: 0402; Supplier 1: Mouser; Supplier Part Number 1: 603-RC0402FR-07909KL; Value: 909k
R98 R99 R122 = RES 90.9K OHM 1% 1/16W 0402: as R12 on sheet PWR; Package: 0402; Supplier 1: Mouser; Supplier Part Number 1: 603-RC0402FR-0790K9L; Value: 90.9k
R100 = RES 2K OHM 1% 1/16W 0402: Manufacturer: Yageo; Manufacturer Part Number: RC0402FR-072KL; Tolerance: 1%; Package: 0402; Supplier 1: Mouser; Supplier Part Number 1: 603-RC0402FR-072KL; Value: 2K
R118 R119 = RES 1K OHM 1% 1/10W 0402: House Part Number: R-1K-0402-1%-001; Manufacturer: Yageo; Manufacturer Part Number: RC0402FR-071KL; Tolerance: 1%; Package: 0402; Supplier 1: Mouser; Supplier Part Number 1: 603-RC0402FR-071KL; Value: 1K
R123 = RES DNP 0402: Tolerance: 1%; Package: 0402; Value: DNP
R124 = TRIMMER 5K OHM 0.1W J LEAD TOP: Manufacturer: Bourns; Manufacturer Part Number: TC33X-2-502E; Tolerance: 1%; Supplier 1: Mouser; Supplier Part Number 1: 652-TC33X-2-502E; Value: 5K
SHLD2 = SHIELD 2118727-2: Manufacturer: TE Connectivity AMP; Supplier 1: Mouser; Supplier Part Number 1: 571-2118727-2; Manufacturer Part Number: 2118727-2
SHLD3 = SHIELD 2118728-2: Manufacturer: TE Connectivity; Supplier 1: Mouser; Supplier Part Number 1: 571-2118728-2; Manufacturer Part Number: 2118728-2
TP22-TP26 = TP PCB 1mm
U7 = IC PGA LMH6518: Manufacturer: Texas Instruments; Manufacturer Part Number: LMH6518SQE/NOPB; Supplier 1: Texas Instruments; Supplier Part Number 1: LMH6518SQX/NOPB
U9 = IC BUFFER AMP BUF802: Manufacturer: Texas Instruments; Manufacturer Part Number: BUF802IRGTR; Supplier 1: Texas Instruments; Supplier Part Number 1: BUF802IRGTR
U10 = IC SWITCH SPST TS12A4516DBVR: Manufacturer: Texas Instruments; Supplier 1: Texas Instruments; Supplier Part Number 1: TS12A4516DBVR; Manufacturer Part Number: TS12A4516DBVR
U18 = IC OPAMP OPA140: Manufacturer: Texas Instruments; Supplier 1: Texas Instruments; Supplier Part Number 1: OPA140AIDR; Manufacturer Part Number: OPA140AIDR

## Sheet ADC.SchDoc: ThunderScope 1000E
size A4; DrawnBy: Aleksa Bjelogrlic; Revision: 1; SheetNumber: 5; SheetTotal: 14
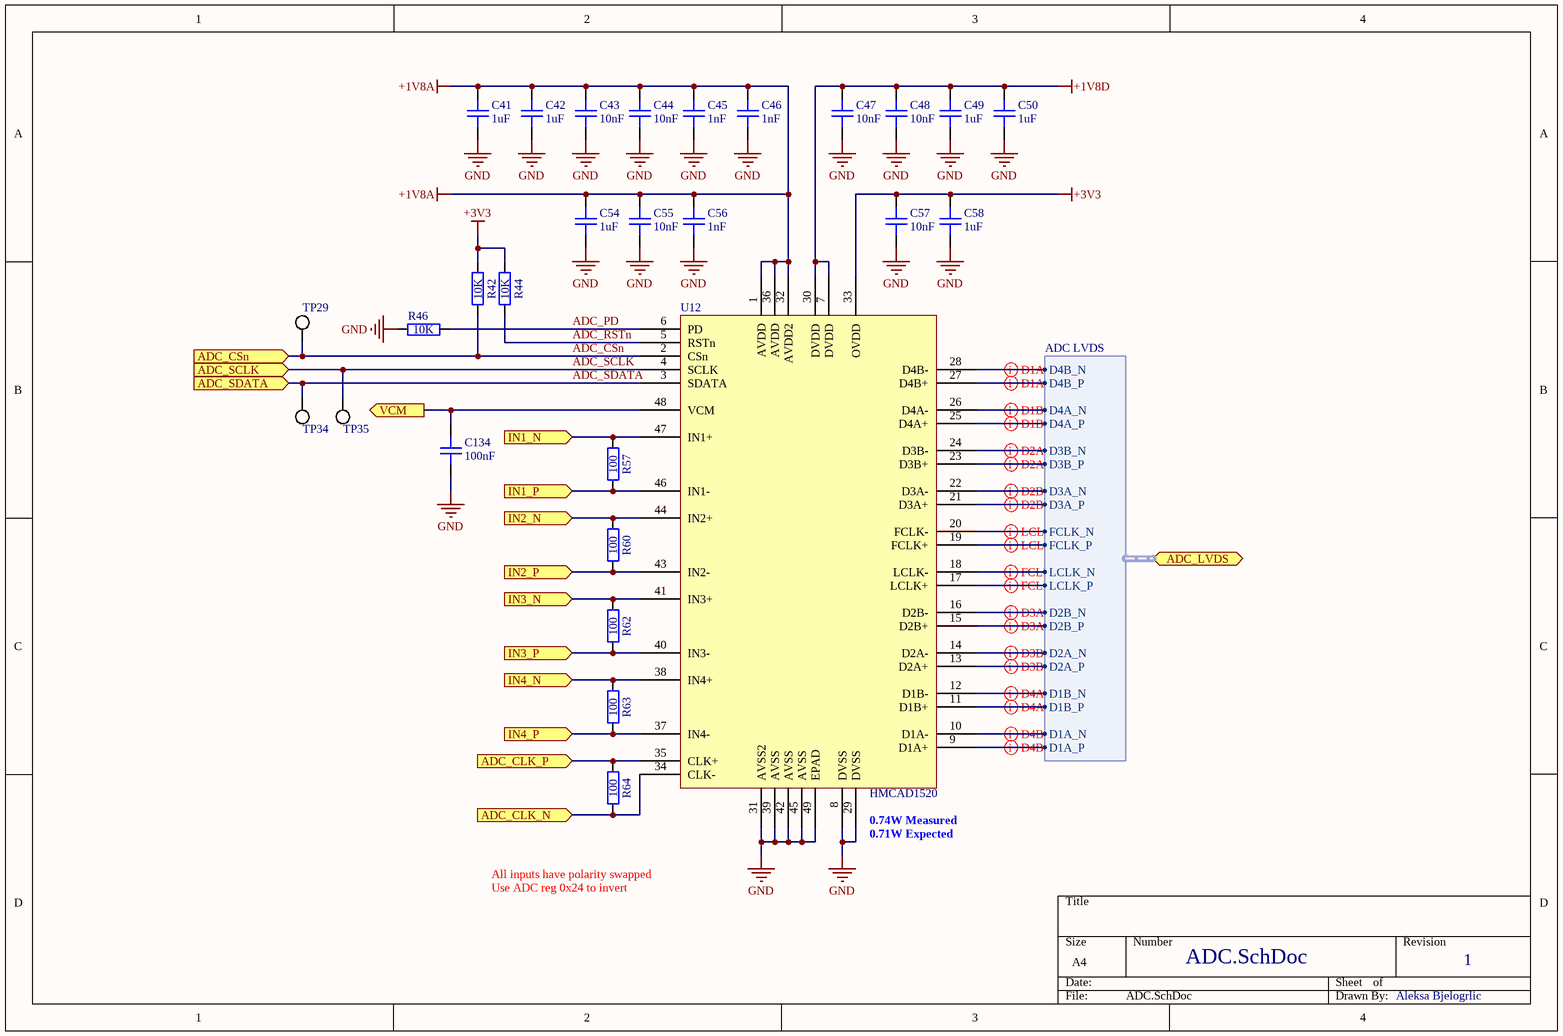
[diagram p12: ADC.SchDoc]

### Parts
C41  1uF  [GEN_C_0402]
C42  1uF  [GEN_C_0402]
C43  10nF  [GEN_C_0402]
C44  10nF  [GEN_C_0402]
C45  1nF  [GEN_C_0402]
C46  1nF  [GEN_C_0402]
C47  10nF  [GEN_C_0402]
C48  10nF  [GEN_C_0402]
C49  1uF  [GEN_C_0402]
C50  1uF  [GEN_C_0402]
C54  1uF  [GEN_C_0402]
C55  10nF  [GEN_C_0402]
C56  1nF  [GEN_C_0402]
C57  10nF  [GEN_C_0402]
C58  1uF  [GEN_C_0402]
C134  100nF  [GEN_C_0402]
R42  10K  [GEN_R_0402]
R44  10K  [GEN_R_0402]
R46  10K  [GEN_R_0402]
R57  100  [GEN_R_0402]
R60  100  [GEN_R_0402]
R62  100  [GEN_R_0402]
R63  100  [GEN_R_0402]
R64  100  [GEN_R_0402]
TP29  PCB  [GEN_TP_PCB]  (value not drawn)  (no BOM)
TP34  PCB  [GEN_TP_PCB]  (value not drawn)  (no BOM)
TP35  PCB  [GEN_TP_PCB]  (value not drawn)  (no BOM)
U12  HMCAD1520  [AD_QFN48_LP7]

### Ports
ADC_CLK_N (in), ADC_CLK_P (in), ADC_CSn (in), ADC_LVDS (bidir, harness ADC LVDS), ADC_SCLK (in), ADC_SDATA (in), IN1_N (in), IN1_P (in), IN2_N (in), IN2_P (in), IN3_N (in), IN3_P (in), IN4_N (in), IN4_P (in), VCM (out)

### Harnesses
ADC LVDS: D4B_N, D4B_P, D4A_N, D4A_P, D3B_N, D3B_P, D3A_N, D3A_P, FCLK_N, FCLK_P, LCLK_N, LCLK_P, D2B_N, D2B_P, D2A_N, D2A_P, D1B_N, D1B_P, D1A_N, D1A_P

### Nets
+1V8A: C41.2 C42.2 C43.2 C44.2 C45.2 C46.2 C54.2 C55.2 C56.2 U12.1(AVDD) U12.32(AVDD2) U12.36(AVDD)
+1V8D: C47.2 C48.2 C49.2 C50.2 U12.7(DVDD) U12.30(DVDD)
+3V3: C57.2 C58.2 R42.2 R44.2 U12.33(OVDD)
GND: C41.1 C42.1 C43.1 C44.1 C45.1 C46.1 C47.1 C48.1 C49.1 C50.1 C54.1 C55.1 C56.1 C57.1 C58.1 C134.1 R46.2 U12.8(DVSS) U12.29(DVSS) U12.31(AVSS2) U12.39(AVSS) U12.42(AVSS) U12.45(AVSS) U12.49(EPAD)
ADC_CLK_N: R64.1 U12.34(CLK-) ; port ADC_CLK_N
ADC_CLK_P: R64.2 U12.35(CLK+) ; port ADC_CLK_P
ADC_CSn: R42.1 TP29.1 U12.2(CSn) ; port ADC_CSn
ADC_PD: R46.1 U12.6(PD)
ADC_RSTn: R44.1 U12.5(RSTn)
ADC_SCLK: TP35.1 U12.4(SCLK) ; port ADC_SCLK
ADC_SDATA: TP34.1 U12.3(SDATA) ; port ADC_SDATA
CH1_N: R57.2 U12.47(IN1+) ; port IN1_N
CH1_P: R57.1 U12.46(IN1-) ; port IN1_P
CH2_N: R60.2 U12.44(IN2+) ; port IN2_N
CH2_P: R60.1 U12.43(IN2-) ; port IN2_P
CH3_N: R62.2 U12.41(IN3+) ; port IN3_N
CH3_P: R62.1 U12.40(IN3-) ; port IN3_P
CH4_N: R63.2 U12.38(IN4+) ; port IN4_N
CH4_P: R63.1 U12.37(IN4-) ; port IN4_P
D1A_N: U12.10(D1A-) ; port ADC_LVDS.D1A_N
D1A_P: U12.9(D1A+) ; port ADC_LVDS.D1A_P
D1B_N: U12.12(D1B-) ; port ADC_LVDS.D1B_N
D1B_P: U12.11(D1B+) ; port ADC_LVDS.D1B_P
D2A_N: U12.14(D2A-) ; port ADC_LVDS.D2A_N
D2A_P: U12.13(D2A+) ; port ADC_LVDS.D2A_P
D2B_N: U12.16(D2B-) ; port ADC_LVDS.D2B_N
D2B_P: U12.15(D2B+) ; port ADC_LVDS.D2B_P
D3A_N: U12.22(D3A-) ; port ADC_LVDS.D3A_N
D3A_P: U12.21(D3A+) ; port ADC_LVDS.D3A_P
D3B_N: U12.24(D3B-) ; port ADC_LVDS.D3B_N
D3B_P: U12.23(D3B+) ; port ADC_LVDS.D3B_P
D4A_N: U12.26(D4A-) ; port ADC_LVDS.D4A_N
D4A_P: U12.25(D4A+) ; port ADC_LVDS.D4A_P
D4B_N: U12.28(D4B-) ; port ADC_LVDS.D4B_N
D4B_P: U12.27(D4B+) ; port ADC_LVDS.D4B_P
FCLK_N: U12.20(FCLK-) ; port ADC_LVDS.FCLK_N
FCLK_P: U12.19(FCLK+) ; port ADC_LVDS.FCLK_P
LCLK_N: U12.18(LCLK-) ; port ADC_LVDS.LCLK_N
LCLK_P: U12.17(LCLK+) ; port ADC_LVDS.LCLK_P
VCM: C134.2 U12.48(VCM) ; port VCM

### Layout directives
differential pair: D1A_N, D1A_P, D1B_N, D1B_P, D2A_N, D2A_P, D2B_N, D2B_P, D3A_N, D3A_P, D3B_N, D3B_P, D4A_N, D4A_P, D4B_N, D4B_P, FCLK_N, FCLK_P, LCLK_N, LCLK_P

### Notes on the sheet
- (near U12) 0.74W Measured
- (near U12) 0.71W Expected
- All inputs have polarity swapped
- Use ADC reg 0x24 to invert
- Aleksa Bjelogrlic

### Library data of the parts
C41 C42 C49 C50 C54 C58 = CAP 1uF 25V X5R 0402: as C9 on sheet PWR; Package: 0402; Supplier 1: Mouser; Supplier Part Number 1: 81-GRM155R61E105KA2D; Value: 1uF
C43 C44 C47 C48 C55 C57 = CAP 10nF 50V X7R 0402: as C33 on sheet FE_Channel; Package: 0402; Supplier 1: Mouser; Supplier Part Number 1: 81-GRM155R71H103KA8J; Value: 10nF
C45 C46 C56 = CAP 1nF 50V C0G 0402: as C4 on sheet PWR; Package: 0402; Supplier 1: Mouser; Supplier Part Number 1: 81-GRM1555C1H102FA1D; Value: 1nF
C134 = CAP 100nF 16V X7R 0402: as C59 on sheet PWR; Package: 0402; Supplier 1: Mouser; Supplier Part Number 1: 81-GCM155R71C104KA5D; Value: 100nF
R42 R44 R46 = RES 10K OHM 1% 1/10W 0402: as R6 on sheet PWR; Package: 0402; Supplier 1: Mouser; Supplier Part Number 1: 667-ERJ-2RKF1002X; Value: 10K
R57 R60 R62-R64 = RES 100 OHM 1% 1/10W 0402: Manufacturer: Yageo; Manufacturer Part Number: RC0402FR-07100RL; Tolerance: 1%; Package: 0402; Value: 100; Supplier 1: Mouser; Supplier Part Number 1: 603-RC0402FR-07100RL
TP29 TP34 TP35 = TP PCB 1mm
U12 = IC ADC HMCAD1520: Manufacturer: Analog Devices; Supplier 1: Mouser; Supplier Part Number 1: 584-HMCAD1520; Manufacturer Part Number: HMCAD1520

## Sheet PLL.SchDoc: ThunderScope 1000E
size A4; SheetNumber: 4; SheetTotal: 14
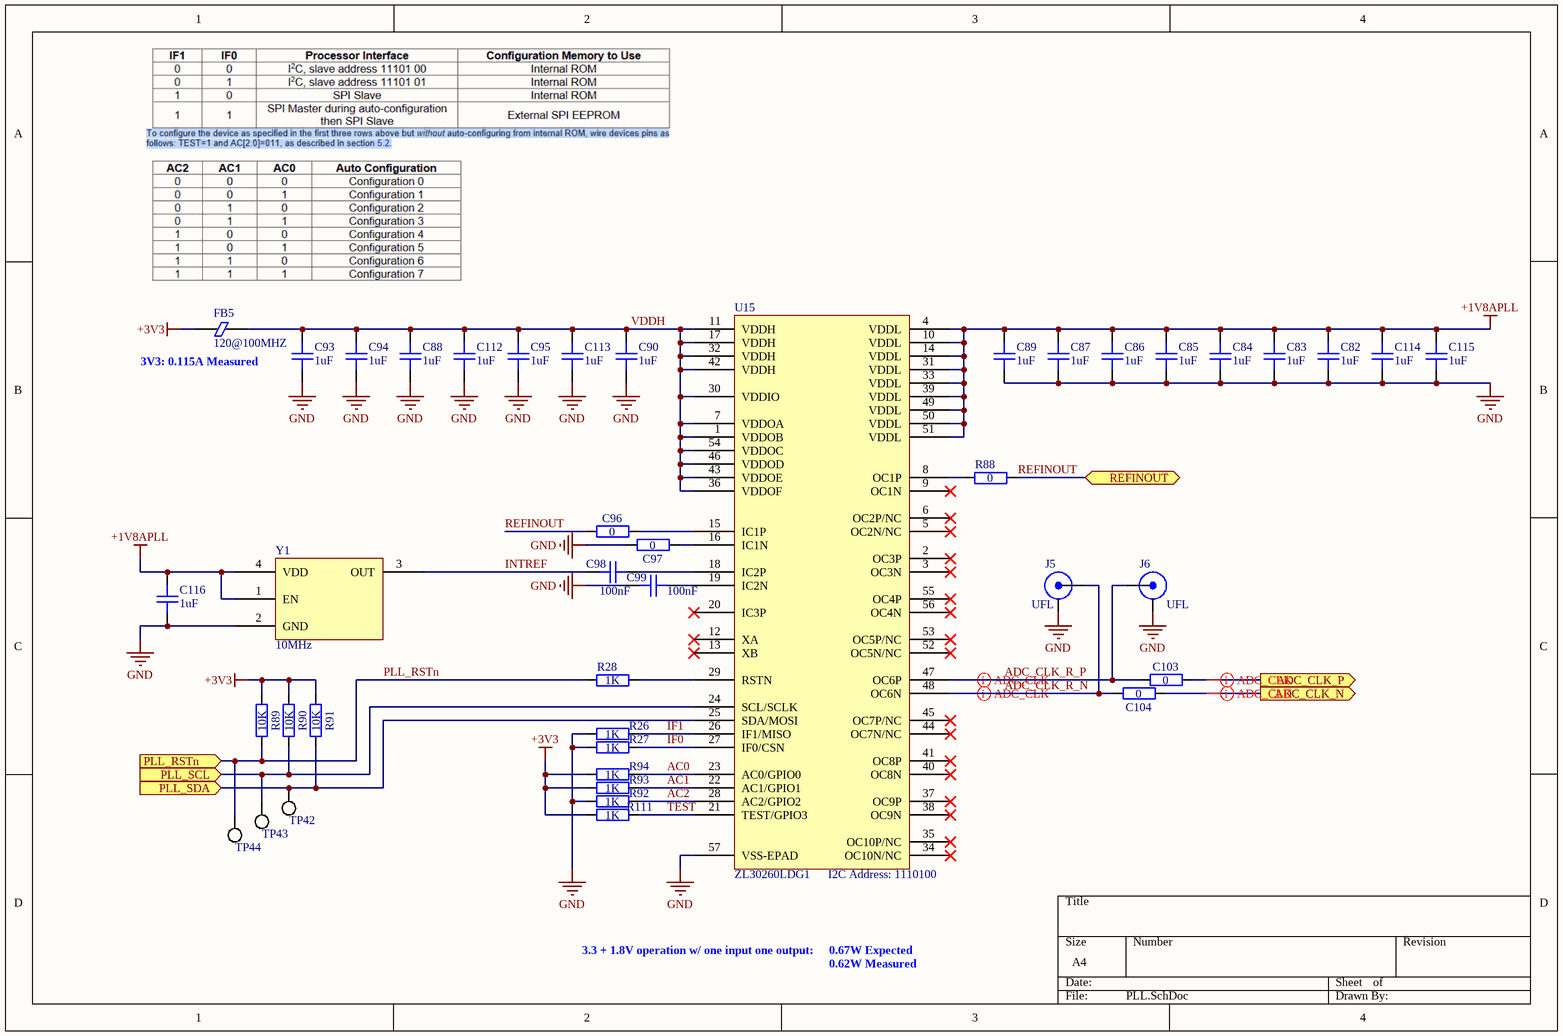
[diagram p13: PLL.SchDoc]

### Parts
C82  1uF  [GEN_C_0402]
C83  1uF  [GEN_C_0402]
C84  1uF  [GEN_C_0402]
C85  1uF  [GEN_C_0402]
C86  1uF  [GEN_C_0402]
C87  1uF  [GEN_C_0402]
C88  1uF  [GEN_C_0402]
C89  1uF  [GEN_C_0402]
C90  1uF  [GEN_C_0402]
C93  1uF  [GEN_C_0402]
C94  1uF  [GEN_C_0402]
C95  1uF  [GEN_C_0402]
C96  0  [GEN_R_0402]
C97  0  [GEN_R_0402]
C98  100nF  [GEN_C_0402]
C99  100nF  [GEN_C_0402]
C103  0  [GEN_R_0402]
C104  0  [GEN_R_0402]
C112  1uF  [GEN_C_0402]
C113  1uF  [GEN_C_0402]
C114  1uF  [GEN_C_0402]
C115  1uF  [GEN_C_0402]
C116  1uF  [GEN_C_0402]
FB5  120@100MHZ  [GEN_R_0402]
J5  UFL  [TE_2334884-1]
J6  UFL  [TE_2334884-1]
R26  1K  [GEN_R_0402]
R27  1K  [GEN_R_0402]
R28  1K  [GEN_R_0402]
R88  0  [GEN_R_0402]
R89  10K  [GEN_R_0402]
R90  10K  [GEN_R_0402]
R91  10K  [GEN_R_0402]
R92  1K  [GEN_R_0402]
R93  1K  [GEN_R_0402]
R94  1K  [GEN_R_0402]
R111  1K  [GEN_R_0402]
TP42  PCB  [GEN_TP_PCB]  (value not drawn)  (no BOM)
TP43  PCB  [GEN_TP_PCB]  (value not drawn)  (no BOM)
TP44  PCB  [GEN_TP_PCB]  (value not drawn)  (no BOM)
U15  ZL30260LDG1  [MC_QFN56_ZL30260]
Y1  10MHz  [ECS_TXO-3225]

### Ports
ADC_CLK_N (out), ADC_CLK_P (out), PLL_RSTn (in), PLL_SCL (in), PLL_SDA (in), REFINOUT (bidir)

### Nets
+1V8APLL: C82.1 C83.1 C84.1 C85.1 C86.1 C87.1 C89.1 C114.1 C115.1 C116.1 U15.4(VDDL) U15.10(VDDL) U15.14(VDDL) U15.31(VDDL) U15.33(VDDL) U15.39(VDDL) U15.49(VDDL) U15.50(VDDL) U15.51(VDDL) Y1.1(EN) Y1.4(VDD)
+3V3: FB5.1 R89.2 R90.2 R91.2 R93.1 R94.1 R111.1
GND: C82.2 C83.2 C84.2 C85.2 C86.2 C87.2 C88.2 C89.2 C90.2 C93.2 C94.2 C95.2 C97.2 C99.2 C112.2 C113.2 C114.2 C115.2 C116.2 J5.2(SHIELD) J6.2(SHIELD) R26.1 R27.1 R92.1 U15.57(VSS-EPAD) Y1.2(GND)
AC0: R94.2 U15.23(AC0/GPIO0)
AC1: R93.2 U15.22(AC1/GPIO1)
AC2: R92.2 U15.28(AC2/GPIO2)
ADC_CLK_N: C104.1 ; port ADC_CLK_N
ADC_CLK_P: C103.1 ; port ADC_CLK_P
ADC_CLK_R_N: C104.2 J5.1(Signal) U15.48(OC6N)
ADC_CLK_R_P: C103.2 J6.1(Signal) U15.47(OC6P)
IF0: R27.2 U15.27(IF0/CSN)
IF1: R26.2 U15.26(IF1/MISO)
INTREF: C98.2 Y1.3(OUT)
PLL_RSTn: R28.2 R89.1 TP44.1 ; port PLL_RSTn  [project net OSC_OE]
REFINOUT: C96.2 R88.2 ; port REFINOUT
SCL: R90.1 TP43.1 U15.24(SCL/SCLK) ; port PLL_SCL
SDA: R91.1 TP42.1 U15.25(SDA/MOSI) ; port PLL_SDA
TEST: R111.2 U15.21(TEST/GPIO3)
VDDH: C88.1 C90.1 C93.1 C94.1 C95.1 C112.1 C113.1 FB5.2 U15.1(VDDOB) U15.7(VDDOA) U15.11(VDDH) U15.17(VDDH) U15.30(VDDIO) U15.32(VDDH) U15.36(VDDOF) U15.42(VDDH) U15.43(VDDOE) U15.46(VDDOD) U15.54(VDDOC)
NetC96_1: C96.1 U15.15(IC1P)
NetC97_1: C97.1 U15.16(IC1N)
NetC98_1: C98.1 U15.18(IC2P)
NetC99_1: C99.1 U15.19(IC2N)
NetR28_1: R28.1 U15.29(RSTN)
NetR88_1: R88.1 U15.8(OC1P)

Not connected (* = marked no-connect by the designer): U15 2(OC3P)* 3(OC3N)* 5(OC2N/NC)* 6(OC2P/NC)* 9(OC1N)* 12(XA)* 13(XB)* 20(IC3P)* 34(OC10N/NC)* 35(OC10P/NC)* 37(OC9P)* 38(OC9N)* 40(OC8N)* 41(OC8P)* 44(OC7N/NC)* 45(OC7P/NC)* 52(OC5N/NC)* 53(OC5P/NC)* 55(OC4P)* 56(OC4N)*

### Layout directives
differential pair: ADC_CLK_N, ADC_CLK_P, ADC_CLK_R_N, ADC_CLK_R_P

### Notes on the sheet
- 3V3: 0.115A Measured
- (near U15) I2C Address: 1110100
- 3.3 + 1.8V operation w/ one input one output:
- 0.62W Measured
- 0.67W Expected

### Library data of the parts
C82-C90 C93-C95 C112-C116 = CAP 1uF 25V X5R 0402: as C9 on sheet PWR; Package: 0402; Supplier 1: Mouser; Supplier Part Number 1: 81-GRM155R61E105KA2D; Value: 1uF
C96 C97 C103 C104 R88 = RES 0 OHM 1/16W 0402: as FB4 on sheet FE_Channel; Package: 0402; Supplier 1: Mouser; Supplier Part Number 1: 603-RC0402JR-070RL; Value: 0
C98 C99 = CAP 100nF 16V X7R 0402: as C59 on sheet PWR; Package: 0402; Supplier 1: Mouser; Supplier Part Number 1: 81-GCM155R71C104KA5D; Value: 100nF
FB5 = FERRITE BEAD 120 OHM 0402: as FB1-FB3 on sheet PWR; Supplier 1: Mouser; Supplier Part Number 1: 81-BLM15PX121SN1D; Manufacturer Part Number: BLM15PX121SN1D
J5 J6 = UFL Jack SMD: as J3 on sheet FE_Channel; Supplier 1: Mouser; Supplier Part Number 1: 571-2334884-1
R26-R28 R92-R94 R111 = RES 1K OHM 1% 1/10W 0402: Manufacturer: Yageo; House Part Number: R-1K-0402-1%-001; Manufacturer Part Number: RC0402FR-071KL; Tolerance: 1%; Package: 0402; Supplier 1: Mouser; Supplier Part Number 1: 603-RC0402FR-071KL; Value: 1K
R89-R91 = RES 10K OHM 1% 1/10W 0402: as R6 on sheet PWR; Package: 0402; Supplier 1: Mouser; Supplier Part Number 1: 667-ERJ-2RKF1002X; Value: 10K
TP42-TP44 = TP PCB 1mm
U15 = IC CLK GEN ZL30260LDG1: Manufacturer: Microchip; Manufacturer Part Number: ZL30260LDG1; Supplier 1: Mouser; Supplier Part Number 1: 494-ZL30260LDG1
Y1 = OSC 10MHz ECS-TXO-3225MV: Manufacturer: ECS International; Manufacturer Part Number: ECS-TXO-3225MV-100-TR; Supplier 1: Mouser; Supplier Part Number 1: 520-TXO-3225MV-100-T

## Nets that join several sheets
1V0: FPGA_PWR (30 pins), FPGA_REG (R1046.2)
1V2_MGT: FPGA_MGT (R1041.1), FPGA_PWR (8 pins), FPGA_REG (R1056.2)
1V8: FPGA (J8.6), FPGA_Bank_IO (C1028.1 U1003.8), FPGA_CFG (R1044.2 R1045.2 U1000.R12), FPGA_PWR (16 pins), FPGA_REG (R1050.2)
1V35: FPGA_PWR (27 pins), FPGA_REG (C1084.2 R1055.2 U1009.A2 U1009.B2)
+1V8A: PWR (FB1.2), ADC (12 pins)
+1V8APLL: PWR (FB3.2), PLL (21 pins)
+1V8D: PWR (FB2.2), ADC (6 pins)
+3V3: Main (C1.1 R110.1 U1.5), FE (Q1.2 Q2.2 R20.2 R21.2), PWR (10 pins), CH1 (D2A.1 D3A.1 K1A.1 K2A.1), ADC (5 pins), PLL (7 pins), CH2 (D2B.1 D3B.1 K1B.1 K2B.1), CH3 (D2C.1 D3C.1 K1C.1 K2C.1), CH4 (D2D.1 D3D.1 K1D.1 K2D.1)
+3V3_IN: FPGA_REG (16 pins), M2_KEY_M (R95.2 TP46.1), CON_PCIe_X4 (R87.2 TP41.1), PWR (5 pins)
+3V3_IO: FPGA_Bank_IO (C1000.1 Y1000.1 Y1000.4), FPGA_PWR (13 pins), FPGA_REG (C1077.2 R1051.2)
+3V3_PGA: PWR (C126.2 TP53.1 U20.5), CH1 (C36A.2 R51A.2 U7A.12), CH2 (C36B.2 R51B.2 U7B.12), CH3 (C36C.2 R51C.2 U7C.12), CH4 (C36D.2 R51D.2 U7D.12)
+5V: FE (11 pins), PWR (7 pins), CH1 (C111A.2 C132A.2 FB8A.2 FB9A.1), CH2 (C111B.2 C132B.2 FB8B.2 FB9B.1), CH3 (C111C.2 C132C.2 FB8C.2 FB9C.1), CH4 (C111D.2 C132D.2 FB8D.2 FB9D.1)
+VBIAS: FE (R16.1 TP17.1 U8.2 U8.6), CH1 (C130A.1 FB6A.1), CH2 (C130B.1 FB6B.1), CH3 (C130C.1 FB6C.1), CH4 (C130D.1 FB6D.1)
-5V: FE (C14.2 C18.2 U5.4 U8.4), PWR (R9.2 TP15.1), CH1 (C133A.1 FB10A.1), CH2 (C133B.1 FB10B.1), CH3 (C133C.1 FB10C.1), CH4 (C133D.1 FB10D.1)
-VBIAS: FE (C100.1 R14.2 TP19.1 U5.6), CH1 (C129A.1 FB4A.2), CH2 (C129B.1 FB4B.2), CH3 (C129C.1 FB4C.2), CH4 (C129D.1 FB4D.2)
AGND: FPGA_CFG (5 pins), FPGA_PWR (C1064.1 U1000.J9)
GND: Main (21 pins), FE (14 pins), FPGA (J8.5), FPGA_Bank_IO (5 pins), FPGA_CFG (7 pins), FPGA_PWR (116 pins), FPGA_REG (25 pins), M2_KEY_M (16 pins), CON_PCIe_X4 (21 pins), PWR (34 pins), CH1 (51 pins), ADC (24 pins), PLL (26 pins), CH2 (51 pins), CH3 (51 pins), CH4 (51 pins)
ACQ_EN: Main (TP33.1), FPGA_Bank_IO (U1000.H16), PWR (R38.2 U14.3)
ADC_CLK_N: ADC (R64.1 U12.34), PLL (C104.1)
ADC_CLK_P: ADC (R64.2 U12.35), PLL (C103.1)
ADC_CSn: FPGA_Bank_IO (U1000.C9), ADC (R42.1 TP29.1 U12.2)
ADC_SCLK: FPGA_Bank_IO (U1000.A9), CH1 (U7A.11), ADC (TP35.1 U12.4)
ADC_SDATA: FPGA_Bank_IO (U1000.D11), CH1 (U7A.10), ADC (TP34.1 U12.3)
ATTEN_1: FPGA_Bank_IO (U1000.A13), CH1 (R47A.2 R49A.2 TP22A.1)
ATTEN_2: FPGA_Bank_IO (U1000.B12), CH2 (R47B.2 R49B.2 TP22B.1)
ATTEN_3: FPGA_Bank_IO (U1000.F18), CH3 (R47C.2 R49C.2 TP22C.1)
ATTEN_4: FPGA_Bank_IO (U1000.A10), CH4 (R47D.2 R49D.2 TP22D.1)
CH1_N: CH1 (R97A.2), ADC (R57.2 U12.47)
CH1_P: CH1 (R52A.2), ADC (R57.1 U12.46)
CH2_N: ADC (R60.2 U12.44), CH2 (R97B.2)
CH2_P: ADC (R60.1 U12.43), CH2 (R52B.2)
CH3_N: ADC (R62.2 U12.41), CH3 (R97C.2)
CH3_P: ADC (R62.1 U12.40), CH3 (R52C.2)
CH4_N: ADC (R63.2 U12.38), CH4 (R97D.2)
CH4_P: ADC (R63.1 U12.37), CH4 (R52D.2)
D1A_N: FPGA_Bank_IO (U1000.V17), ADC (U12.10)
D1A_P: FPGA_Bank_IO (U1000.V16), ADC (U12.9)
D1B_N: FPGA_Bank_IO (U1000.U17), ADC (U12.12)
D1B_P: FPGA_Bank_IO (U1000.T17), ADC (U12.11)
D2A_N: FPGA_Bank_IO (U1000.U11), ADC (U12.14)
D2A_P: FPGA_Bank_IO (U1000.V11), ADC (U12.13)
D2B_N: FPGA_Bank_IO (U1000.U9), ADC (U12.16)
D2B_P: FPGA_Bank_IO (U1000.V9), ADC (U12.15)
D3A_N: FPGA_Bank_IO (U1000.V13), ADC (U12.22)
D3A_P: FPGA_Bank_IO (U1000.V12), ADC (U12.21)
D3B_N: FPGA_Bank_IO (U1000.U15), ADC (U12.24)
D3B_P: FPGA_Bank_IO (U1000.U16), ADC (U12.23)
D4A_N: FPGA_Bank_IO (U1000.U14), ADC (U12.26)
D4A_P: FPGA_Bank_IO (U1000.V14), ADC (U12.25)
D4B_N: FPGA_Bank_IO (U1000.T12), ADC (U12.28)
D4B_P: FPGA_Bank_IO (U1000.U12), ADC (U12.27)
DC_CPL_1: FPGA_Bank_IO (U1000.C18), CH1 (R126A.2 R127A.2 TP26A.1)
DC_CPL_2: FPGA_Bank_IO (U1000.A12), CH2 (R126B.2 R127B.2 TP26B.1)
DC_CPL_3: FPGA_Bank_IO (U1000.H17), CH3 (R126C.2 R127C.2 TP26C.1)
DC_CPL_4: FPGA_Bank_IO (U1000.C17), CH4 (R126D.2 R127D.2 TP26D.1)
FCLK_N: FPGA_Bank_IO (U1000.T18), ADC (U12.20)
FCLK_P: FPGA_Bank_IO (U1000.R18), ADC (U12.19)
FE_EN: Main (TP7.1), FPGA_Bank_IO (U1000.C8), PWR (R6.1 U2.2)
LCLK_N: FPGA_Bank_IO (U1000.T15), ADC (U12.18)
LCLK_P: FPGA_Bank_IO (U1000.T14), ADC (U12.17)
M2_PER0_N: FPGA (C76.1), M2_KEY_M (J10.42)
M2_PER0_P: FPGA (C77.1), M2_KEY_M (J10.44)
M2_PER1_N: FPGA (C72.1), M2_KEY_M (J10.30)
M2_PER1_P: FPGA (C73.1), M2_KEY_M (J10.32)
M2_PER2_N: FPGA (C68.1), M2_KEY_M (J10.18)
M2_PER2_P: FPGA (C69.1), M2_KEY_M (J10.20)
M2_PER3_N: FPGA (C16.1), M2_KEY_M (J10.6)
M2_PER3_P: FPGA (C65.1), M2_KEY_M (J10.8)
M2_PERST#: FPGA (R85.2), M2_KEY_M (J10.49)
M2_PET0_N: FPGA (R82.2), M2_KEY_M (J10.48)
M2_PET0_P: FPGA (R83.2), M2_KEY_M (J10.50)
M2_PET1_N: FPGA (R78.2), M2_KEY_M (J10.36)
M2_PET1_P: FPGA (R79.2), M2_KEY_M (J10.38)
M2_PET2_N: FPGA (R74.2), M2_KEY_M (J10.24)
M2_PET2_P: FPGA (R75.2), M2_KEY_M (J10.26)
M2_PET3_N: FPGA (R70.2), M2_KEY_M (J10.12)
M2_PET3_P: FPGA (R71.2), M2_KEY_M (J10.14)
M2_REFCLK_N: FPGA (C80.1), M2_KEY_M (J10.54)
M2_REFCLK_P: FPGA (C81.1), M2_KEY_M (J10.56)
MGT_CLK1_N: FPGA (C40.2 C80.2), FPGA_MGT (U1000.B5)
MGT_CLK1_P: FPGA (C79.2 C81.2), FPGA_MGT (U1000.B6)
MGT_RX0_N: FPGA (R68.1 R70.1), FPGA_MGT (U1000.E3)
MGT_RX0_P: FPGA (R69.1 R71.1), FPGA_MGT (U1000.E4)
MGT_RX1_N: FPGA (R72.1 R74.1), FPGA_MGT (U1000.A3)
MGT_RX1_P: FPGA (R73.1 R75.1), FPGA_MGT (U1000.A4)
MGT_RX2_N: FPGA (R76.1 R78.1), FPGA_MGT (U1000.C3)
MGT_RX2_P: FPGA (R77.1 R79.1), FPGA_MGT (U1000.C4)
MGT_RX3_N: FPGA (R80.1 R82.1), FPGA_MGT (U1000.G3)
MGT_RX3_P: FPGA (R81.1 R83.1), FPGA_MGT (U1000.G4)
MGT_TX0_N: FPGA (C16.2 C62.2), FPGA_MGT (U1000.H1)
MGT_TX0_P: FPGA (C15.2 C65.2), FPGA_MGT (U1000.H2)
MGT_TX1_N: FPGA (C66.2 C68.2), FPGA_MGT (U1000.F1)
MGT_TX1_P: FPGA (C67.2 C69.2), FPGA_MGT (U1000.F2)
MGT_TX2_N: FPGA (C70.2 C72.2), FPGA_MGT (U1000.D1)
MGT_TX2_P: FPGA (C71.2 C73.2), FPGA_MGT (U1000.D2)
MGT_TX3_N: FPGA (C74.2 C76.2), FPGA_MGT (U1000.B1)
MGT_TX3_P: FPGA (C75.2 C77.2), FPGA_MGT (U1000.B2)
OSC_OE: FPGA_Bank_IO (U1000.G15), PLL (R28.2 R89.1 TP44.1)
PCIe_PER0_N: FPGA (C74.1), CON_PCIe_X4 (P1.A17)
PCIe_PER0_P: FPGA (C75.1), CON_PCIe_X4 (P1.A16)
PCIe_PER1_N: FPGA (C70.1), CON_PCIe_X4 (P1.A22)
PCIe_PER1_P: FPGA (C71.1), CON_PCIe_X4 (P1.A21)
PCIe_PER2_N: FPGA (C66.1), CON_PCIe_X4 (P1.A26)
PCIe_PER2_P: FPGA (C67.1), CON_PCIe_X4 (P1.A25)
PCIe_PER3_N: FPGA (C62.1), CON_PCIe_X4 (P1.A30)
PCIe_PER3_P: FPGA (C15.1), CON_PCIe_X4 (P1.A29)
PCIe_PERST#: FPGA (R84.2), CON_PCIe_X4 (P1.A11)
PCIe_PET0_N: FPGA (R80.2), CON_PCIe_X4 (P1.B15)
PCIe_PET0_P: FPGA (R81.2), CON_PCIe_X4 (P1.B14)
PCIe_PET1_N: FPGA (R76.2), CON_PCIe_X4 (P1.B20)
PCIe_PET1_P: FPGA (R77.2), CON_PCIe_X4 (P1.B19)
PCIe_PET2_N: FPGA (R72.2), CON_PCIe_X4 (P1.B24)
PCIe_PET2_P: FPGA (R73.2), CON_PCIe_X4 (P1.B23)
PCIe_PET3_N: FPGA (R68.2), CON_PCIe_X4 (P1.B28)
PCIe_PET3_P: FPGA (R69.2), CON_PCIe_X4 (P1.B27)
PCIe_REFCLK_N: FPGA (C40.1), CON_PCIe_X4 (P1.A14)
PCIe_REFCLK_P: FPGA (C79.1), CON_PCIe_X4 (P1.A13)
PERST#: FPGA (R84.1 R85.1 TP39.1), FPGA_Bank_IO (U1000.B10)
PGA_CSn_1: FPGA_Bank_IO (U1000.G17), CH1 (R51A.1 TP24A.1 U7A.9)
PGA_CSn_2: FPGA_Bank_IO (U1000.F14), CH2 (R51B.1 TP24B.1 U7B.9)
PGA_CSn_3: FPGA_Bank_IO (U1000.C11), CH3 (R51C.1 TP24C.1 U7C.9)
PGA_CSn_4: FPGA_Bank_IO (U1000.E18), CH4 (R51D.1 TP24D.1 U7D.9)
PGA_SCLK: CH2 (U7B.11), CH3 (U7C.11), CH4 (U7D.11)
PGA_SDIO: CH2 (U7B.10), CH3 (U7C.10), CH4 (U7D.10)
PROBE_COMP: Main (R2.2 U1.2), FPGA_Bank_IO (U1000.B11)
QSPI_CLK: FPGA_Bank_IO (U1003.6), FPGA_CFG (TP1008.1 U1000.E8)
REFINOUT: Main (R106.2 R107.2), PLL (C96.2 R88.2)
SCL: FE (Q2.3 R21.1), FPGA_Bank_IO (U1000.D9), PLL (R90.1 TP43.1 U15.24)
SDA: FE (Q1.3 R20.1), FPGA_Bank_IO (U1000.G16), PLL (R91.1 TP42.1 U15.25)
SYNC: Main (R108.2 R109.2 R110.2), FPGA_Bank_IO (U1000.H18)
TCK: FPGA (J8.4), FPGA_CFG (U1000.F8)
TDI: FPGA (J8.2), FPGA_CFG (U1000.T9)
TDO: FPGA (J8.3), FPGA_CFG (U1000.T8)
TERM_1: FPGA_Bank_IO (U1000.G14), CH1 (R48A.2 R50A.2 TP23A.1)
TERM_2: FPGA_Bank_IO (U1000.F15), CH2 (R48B.2 R50B.2 TP23B.1)
TERM_3: FPGA_Bank_IO (U1000.F17), CH3 (R48C.2 R50C.2 TP23C.1)
TERM_4: FPGA_Bank_IO (U1000.B9), CH4 (R48D.2 R50D.2 TP23D.1)
TMS: FPGA (J8.1), FPGA_CFG (U1000.R8)
TRIM_1: FE (U17.1), CH1 (C131A.1 FB7A.1)
TRIM_2: FE (U17.8), CH2 (C131B.1 FB7B.1)
TRIM_3: FE (U17.9), CH3 (C131C.1 FB7C.1)
TRIM_4: FE (U17.14), CH4 (C131D.1 FB7D.1)
VCM: Main (TP16.1), CH1 (U7A.13), ADC (C134.2 U12.48), CH2 (U7B.13), CH3 (U7C.13), CH4 (U7D.13)

## Assembly variants
PCIe: not fitted C2 C3 D4 D5 J7 J9 J10 L1 R3 R6 R10 R12 R95 R105 R108 TP3 TP18 TP45 TP46 U2
TB: not fitted D6 D7 J11 R86 R87 R109 R116 SHLD1 TP40 TP41 TP50 TP51